# EAGLE schematic aqc-rev2 (EAGLE 8.3.1)

## Sheet 1 of 12
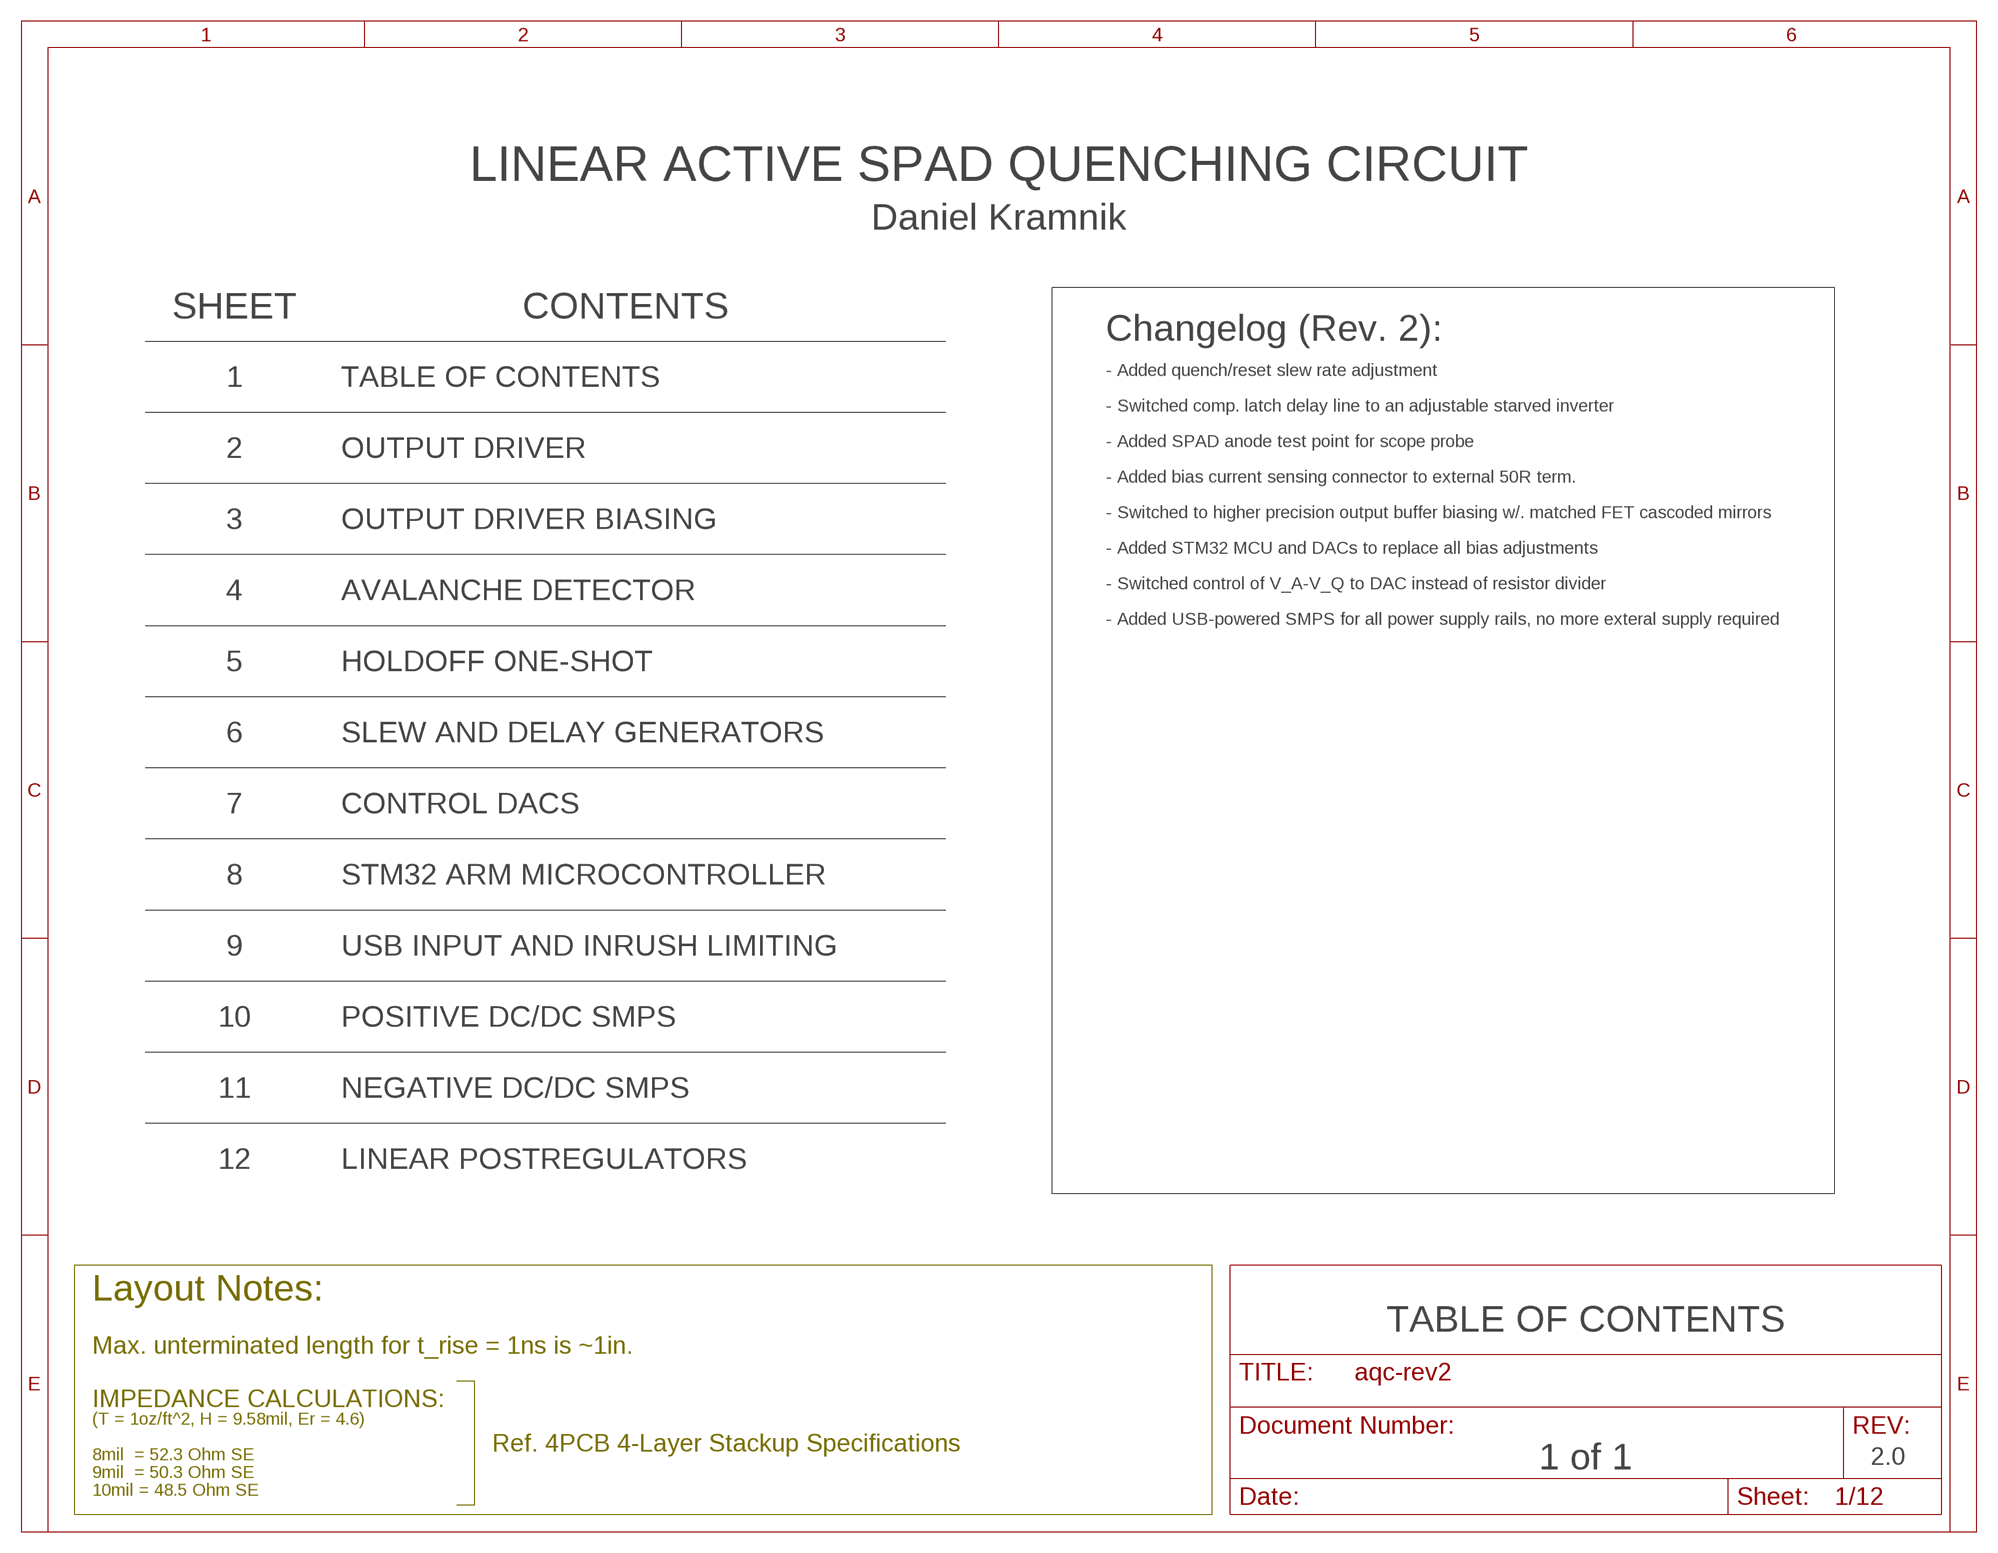
[diagram p0: schematic, sheet 1]

### Notes on the sheet
- LINEAR ACTIVE SPAD QUENCHING CIRCUIT
- Daniel Kramnik
- SHEET | CONTENTS
- Changelog (Rev. 2):
- 1 | TABLE OF CONTENTS | - Added quench/reset slew rate adjustment
- - Switched comp. latch delay line to an adjustable starved inverter
- 2 | OUTPUT DRIVER | - Added SPAD anode test point for scope probe
- - Added bias current sensing connector to external 50R term.
- 3 | OUTPUT DRIVER BIASING | - Switched to higher precision output buffer biasing w/. matched FET cascoded mirrors
- - Added STM32 MCU and DACs to replace all bias adjustments
- 4 | AVALANCHE DETECTOR | - Switched control of V_A-V_Q to DAC instead of resistor divider
- - Added USB-powered SMPS for all power supply rails, no more exteral supply required
- 5 | HOLDOFF ONE-SHOT
- 6 | SLEW AND DELAY GENERATORS
- 7 | CONTROL DACS
- 8 | STM32 ARM MICROCONTROLLER
- 9 | USB INPUT AND INRUSH LIMITING
- 10 | POSITIVE DC/DC SMPS
- 11 | NEGATIVE DC/DC SMPS
- 12 | LINEAR POSTREGULATORS
- Layout Notes:
- TABLE OF CONTENTS
- Max. unterminated length for t_rise = 1ns is ~1in.
- IMPEDANCE CALCULATIONS:
- (T = 1oz/ft^2, H = 9.58mil, Er = 4.6)
- Ref. 4PCB 4-Layer Stackup Specifications | 1 of 1 | 2.0
- 8mil  = 52.3 Ohm SE
- 9mil  = 50.3 Ohm SE
- 10mil = 48.5 Ohm SE

## Sheet 2 of 12
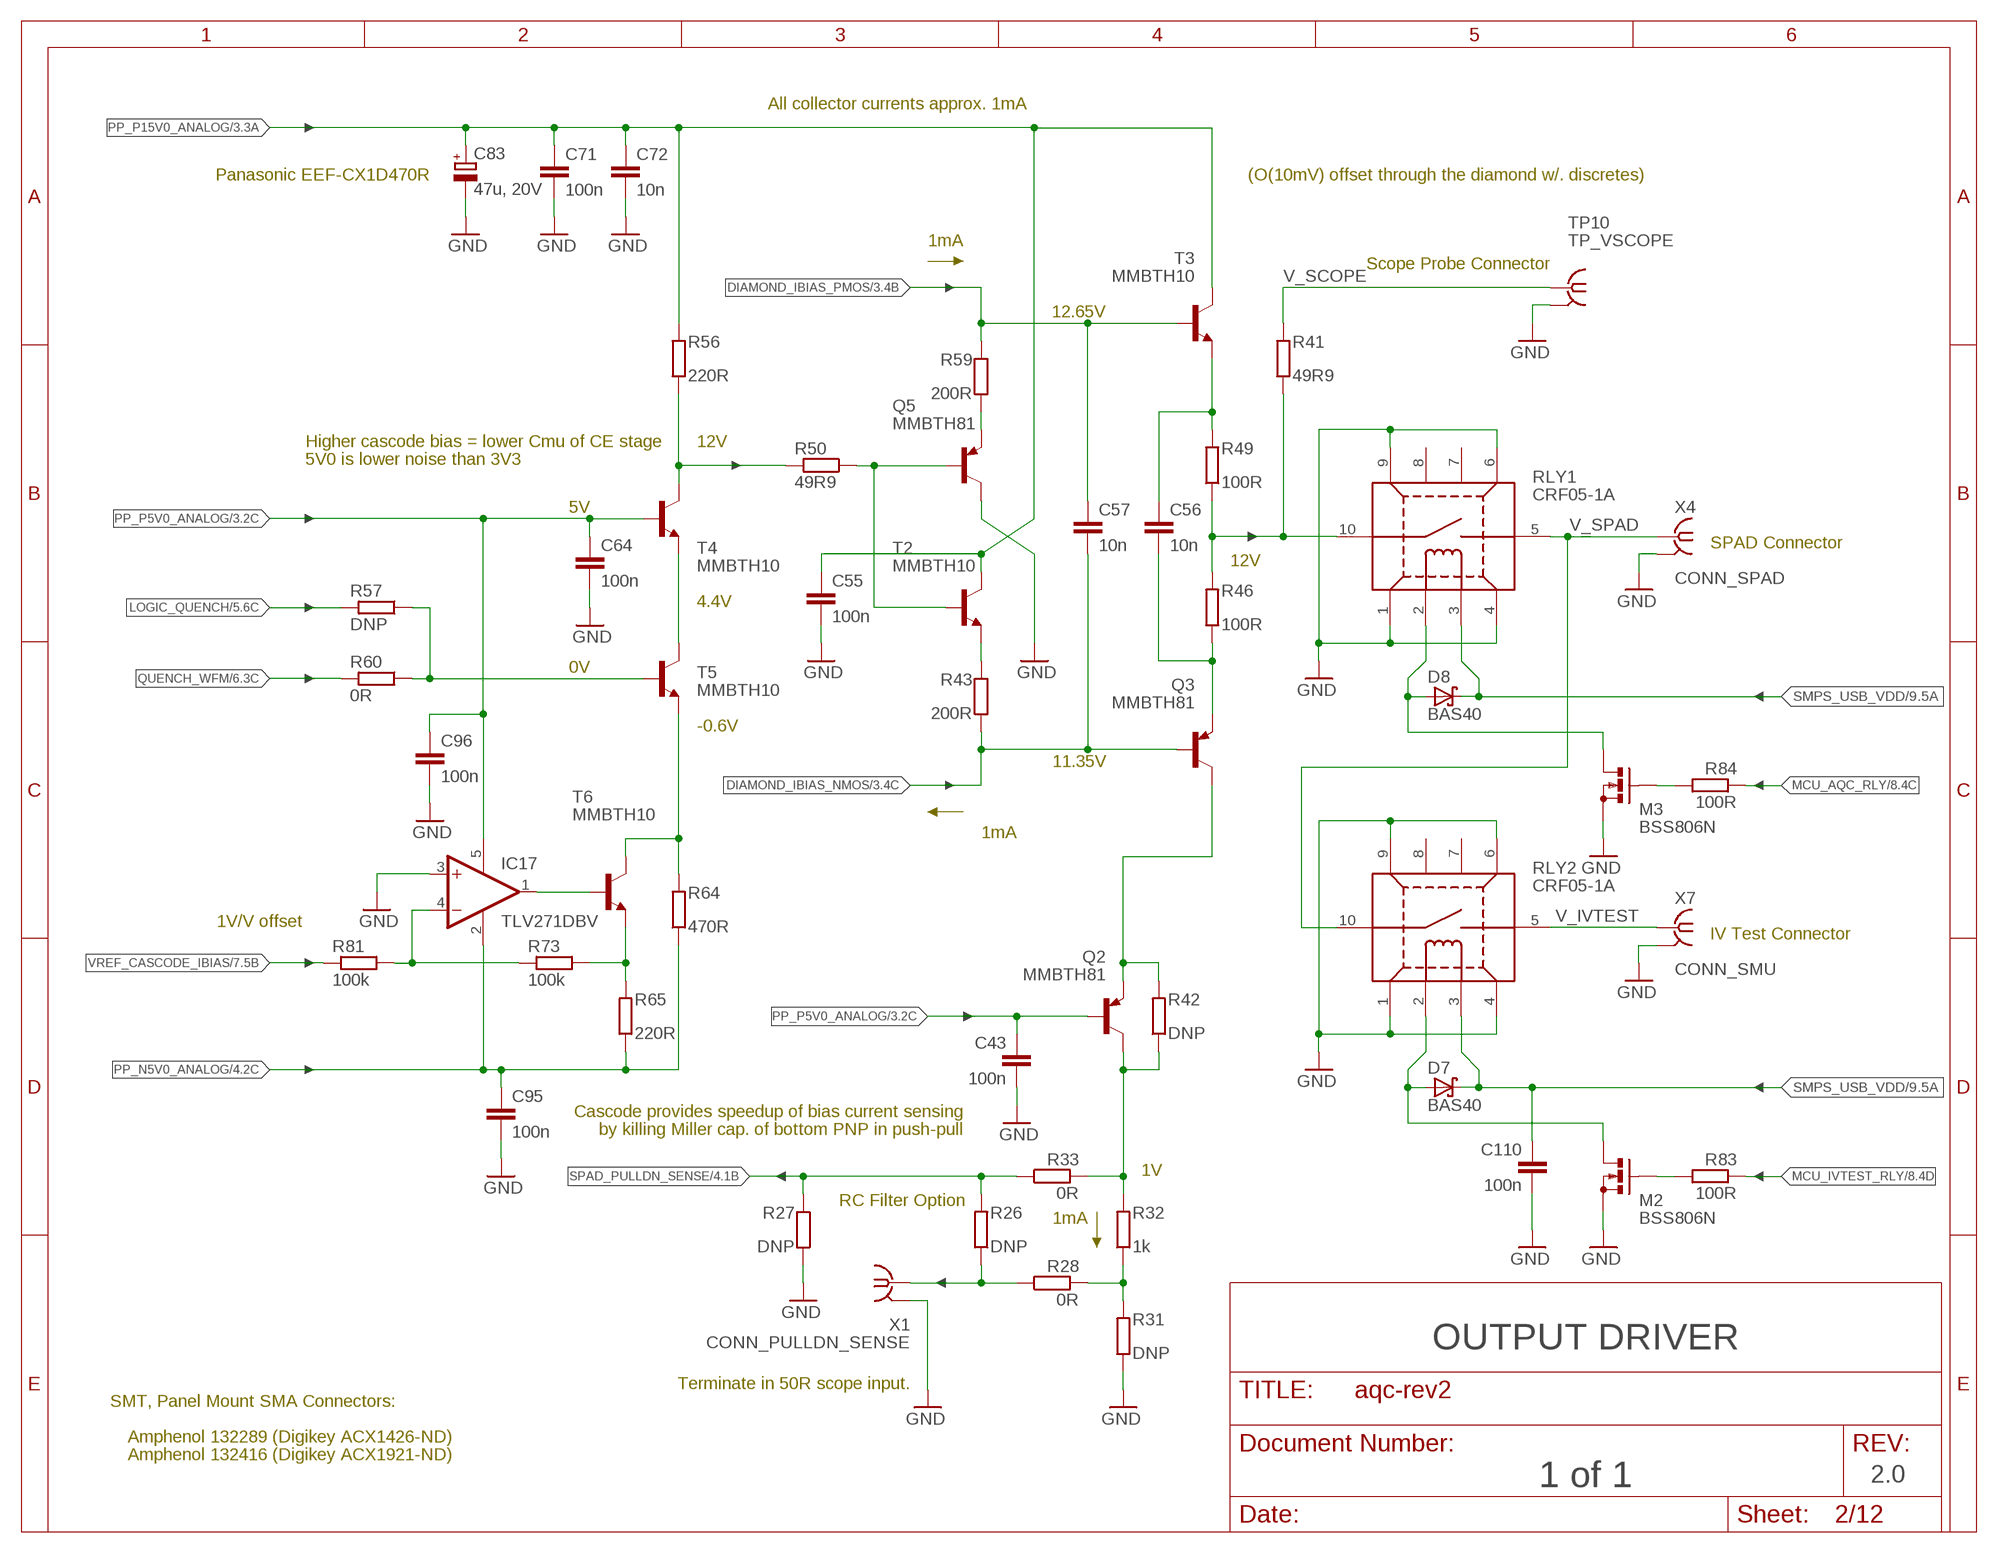
[diagram p1: schematic, sheet 2]

### Parts
C43  100n  C-EUC0603  [C0603]
C55  100n  C-EUC0603  [C0603]
C56  10n  C-EUC0603  [C0603]
C57  10n  C-EUC0603  [C0603]
C64  100n  C-EUC0603  [C0603]
C71  100n  C-EUC0603  [C0603]
C72  10n  C-EUC0603  [C0603]
C83  47u, 20V  CPOL-EUCT7343  [CT7343]
C95  100n  C-EUC0603  [C0603]
C96  100n  C-EUC0603  [C0603]
C110  100n  C-EUC0603  [C0603]
D7  BAS40  [SOT23]
D8  BAS40  [SOT23]
IC17  TLV271DBV  [SOT23-5]
M2  BSS806N  [SOT23R_INFINEON]
M3  BSS806N  [SOT23R_INFINEON]
Q2  MMBTH81  MMBTH81LT1SMD  [SOT23-BEC]
Q3  MMBTH81  MMBTH81LT1SMD  [SOT23-BEC]
Q5  MMBTH81  MMBTH81LT1SMD  [SOT23-BEC]
R26  DNP  R-EU_R0603  [R0603]
R27  DNP  R-EU_R0603  [R0603]
R28  0R  R-EU_R0603  [R0603]
R31  DNP  R-EU_R0603  [R0603]
R32  1k  R-EU_R0603  [R0603]
R33  0R  R-EU_R0603  [R0603]
R41  49R9  R-EU_R0603  [R0603]
R42  DNP  R-EU_R0603  [R0603]
R43  200R  R-EU_R0603  [R0603]
R46  100R  R-EU_R0603  [R0603]
R49  100R  R-EU_R0603  [R0603]
R50  49R9  R-EU_R0603  [R0603]
R56  220R  R-EU_R0603  [R0603]
R57  DNP  R-EU_R0603  [R0603]
R59  200R  R-EU_R0603  [R0603]
R60  0R  R-EU_R0603  [R0603]
R64  470R  R-EU_R0603  [R0603]
R65  220R  R-EU_R0603  [R0603]
R73  100k  R-EU_R0603  [R0603]
R81  100k  R-EU_R0603  [R0603]
R83  100R  R-EU_R0603  [R0603]
R84  100R  R-EU_R0603  [R0603]
RLY1  CRF05-1A  MEDER_CRF05-1A  [MEDER_RELAY_CRF]
RLY2  CRF05-1A  MEDER_CRF05-1A  [MEDER_RELAY_CRF]
T2  MMBTH10  MMBTH10LT1-NPN-SOT23-BEC  [SOT23-BEC]
T3  MMBTH10  MMBTH10LT1-NPN-SOT23-BEC  [SOT23-BEC]
T4  MMBTH10  MMBTH10LT1-NPN-SOT23-BEC  [SOT23-BEC]
T5  MMBTH10  MMBTH10LT1-NPN-SOT23-BEC  [SOT23-BEC]
T6  MMBTH10  MMBTH10LT1-NPN-SOT23-BEC  [SOT23-BEC]
TP10  TP_VSCOPE  TP-SCOPE_H  [JOHNSON-129-0701-30X]
X1  CONN_PULLDN_SENSE  SMA-142-0711-871/876  [J502-ND-142-0711-871/876]
X4  CONN_SPAD  SMA-142-0711-871/876  [J502-ND-142-0711-871/876]
X7  CONN_SMU  SMA-142-0711-871/876  [J502-ND-142-0711-871/876]

### Nets
CASC_BIAS_B: IC17.1(OUT) T6.B
CASC_BIAS_C: R64.2 T5.E T6.C
CASC_BIAS_E: R65.2 R73.1 T6.E
CASC_BIAS_VGND: IC17.4(-IN) R73.2 R81.1
CASC_MIDPT: T4.E T5.C
DIAMOND_IBIAS_NMOS: C57.2 Q3.B R43.1 ; also sheet 3
DIAMOND_IBIAS_PMOS: C57.1 R59.2 T3.B ; also sheet 3
GND: C43.2 C55.2 C64.2 C71.2 C72.2 C83.- C95.2 C96.2 C110.2 IC17.3(+IN) M2.2(S) M3.2(S) Q5.C R27.1 R31.1 RLY1.1(PIN1) RLY1.4(PIN4) RLY1.6(PIN6) RLY1.9(PIN9) RLY2.1(PIN1) RLY2.4(PIN4) RLY2.6(PIN6) RLY2.9(PIN9) TP10.GND1(GND) TP10.GND2(GND) X1.G@1(GND) X4.G@1(GND) X7.G@1(GND) ; also sheet 3,4,5,6,7,8,9,10,11,12
LOGIC_QUENCH: R57.2 ; also sheet 5,6
MCU_AQC_RLY: R84.2 ; also sheet 8
MCU_IVTEST_RLY: R83.2 ; also sheet 8
N$2: R57.1 R60.1 T5.B
N$3: M3.1(G) R84.1
N$4: D8.1(A) M3.3(D) RLY1.2(PIN2)
N$5: C56.1 R49.2 T3.E
N$6: D7.1(A) M2.3(D) RLY2.2(PIN2)
N$10: Q2.E Q3.C R42.2
N$11: Q5.E R59.1
N$13: R43.2 T2.E
N$14: C56.2 Q3.E R46.1
N$15: M2.1(G) R83.1
N$21: Q5.B R50.1 T2.B
N$22: R50.2 R56.1 T4.C
N$23: R41.1 R46.2 R49.1 RLY1.10(PIN10)
N$27: Q2.C R32.2 R33.2 R42.1
N$28: R28.2 R31.2 R32.1
N$32: R26.1 R28.1 X1.1
PP_N5V0_ANALOG: C95.1 IC17.2(V-) R64.1 R65.1 ; also sheet 4,6,12
PP_P5V0_ANALOG: C43.1 C64.1 C96.1 IC17.5(V+) Q2.B T4.B ; also sheet 3,4,6,7,12
PP_P15V0_ANALOG: C55.1 C71.1 C72.1 C83.+ R56.2 T2.C T3.C ; also sheet 3,12
QUENCH_WFM: R60.2 ; also sheet 6
SMPS_USB_VDD: C110.1 D7.3(C) D8.3(C) RLY1.3(PIN3) RLY2.3(PIN3) ; also sheet 9,10,11
SPAD_PULLDN_SENSE: R26.2 R27.2 R33.1 ; also sheet 4
V_IVTEST: RLY2.5(PIN5) X7.1
V_SCOPE: R41.2 TP10.SIG
V_SPAD: RLY1.5(PIN5) RLY2.10(PIN10) X4.1
VREF_CASCODE_IBIAS: R81.2 ; also sheet 7
Unconnected: RLY1.7(PIN7) RLY1.8(PIN8) RLY2.7(PIN7) RLY2.8(PIN8)

### Notes on the sheet
- All collector currents approx. 1mA
- Panasonic EEF-CX1D470R | (O(10mV) offset through the diamond w/. discretes)
- 1mA
- Scope Probe Connector
- 12.65V
- Higher cascode bias = lower Cmu of CE stage | 12V
- 5V0 is lower noise than 3V3
- 5V
- SPAD Connector
- 12V
- 4.4V
- 0V
- -0.6V
- 11.35V
- 1mA
- 1V/V offset | IV Test Connector
- Cascode provides speedup of bias current sensing
- by killing Miller cap. of bottom PNP in push-pull
- 1V
- RC Filter Option
- 1mA
- OUTPUT DRIVER
- Terminate in 50R scope input.
- SMT, Panel Mount SMA Connectors:
- Amphenol 132289 (Digikey ACX1426-ND)
- Amphenol 132416 (Digikey ACX1921-ND)
- 1 of 1 | 2.0

## Sheet 3 of 12
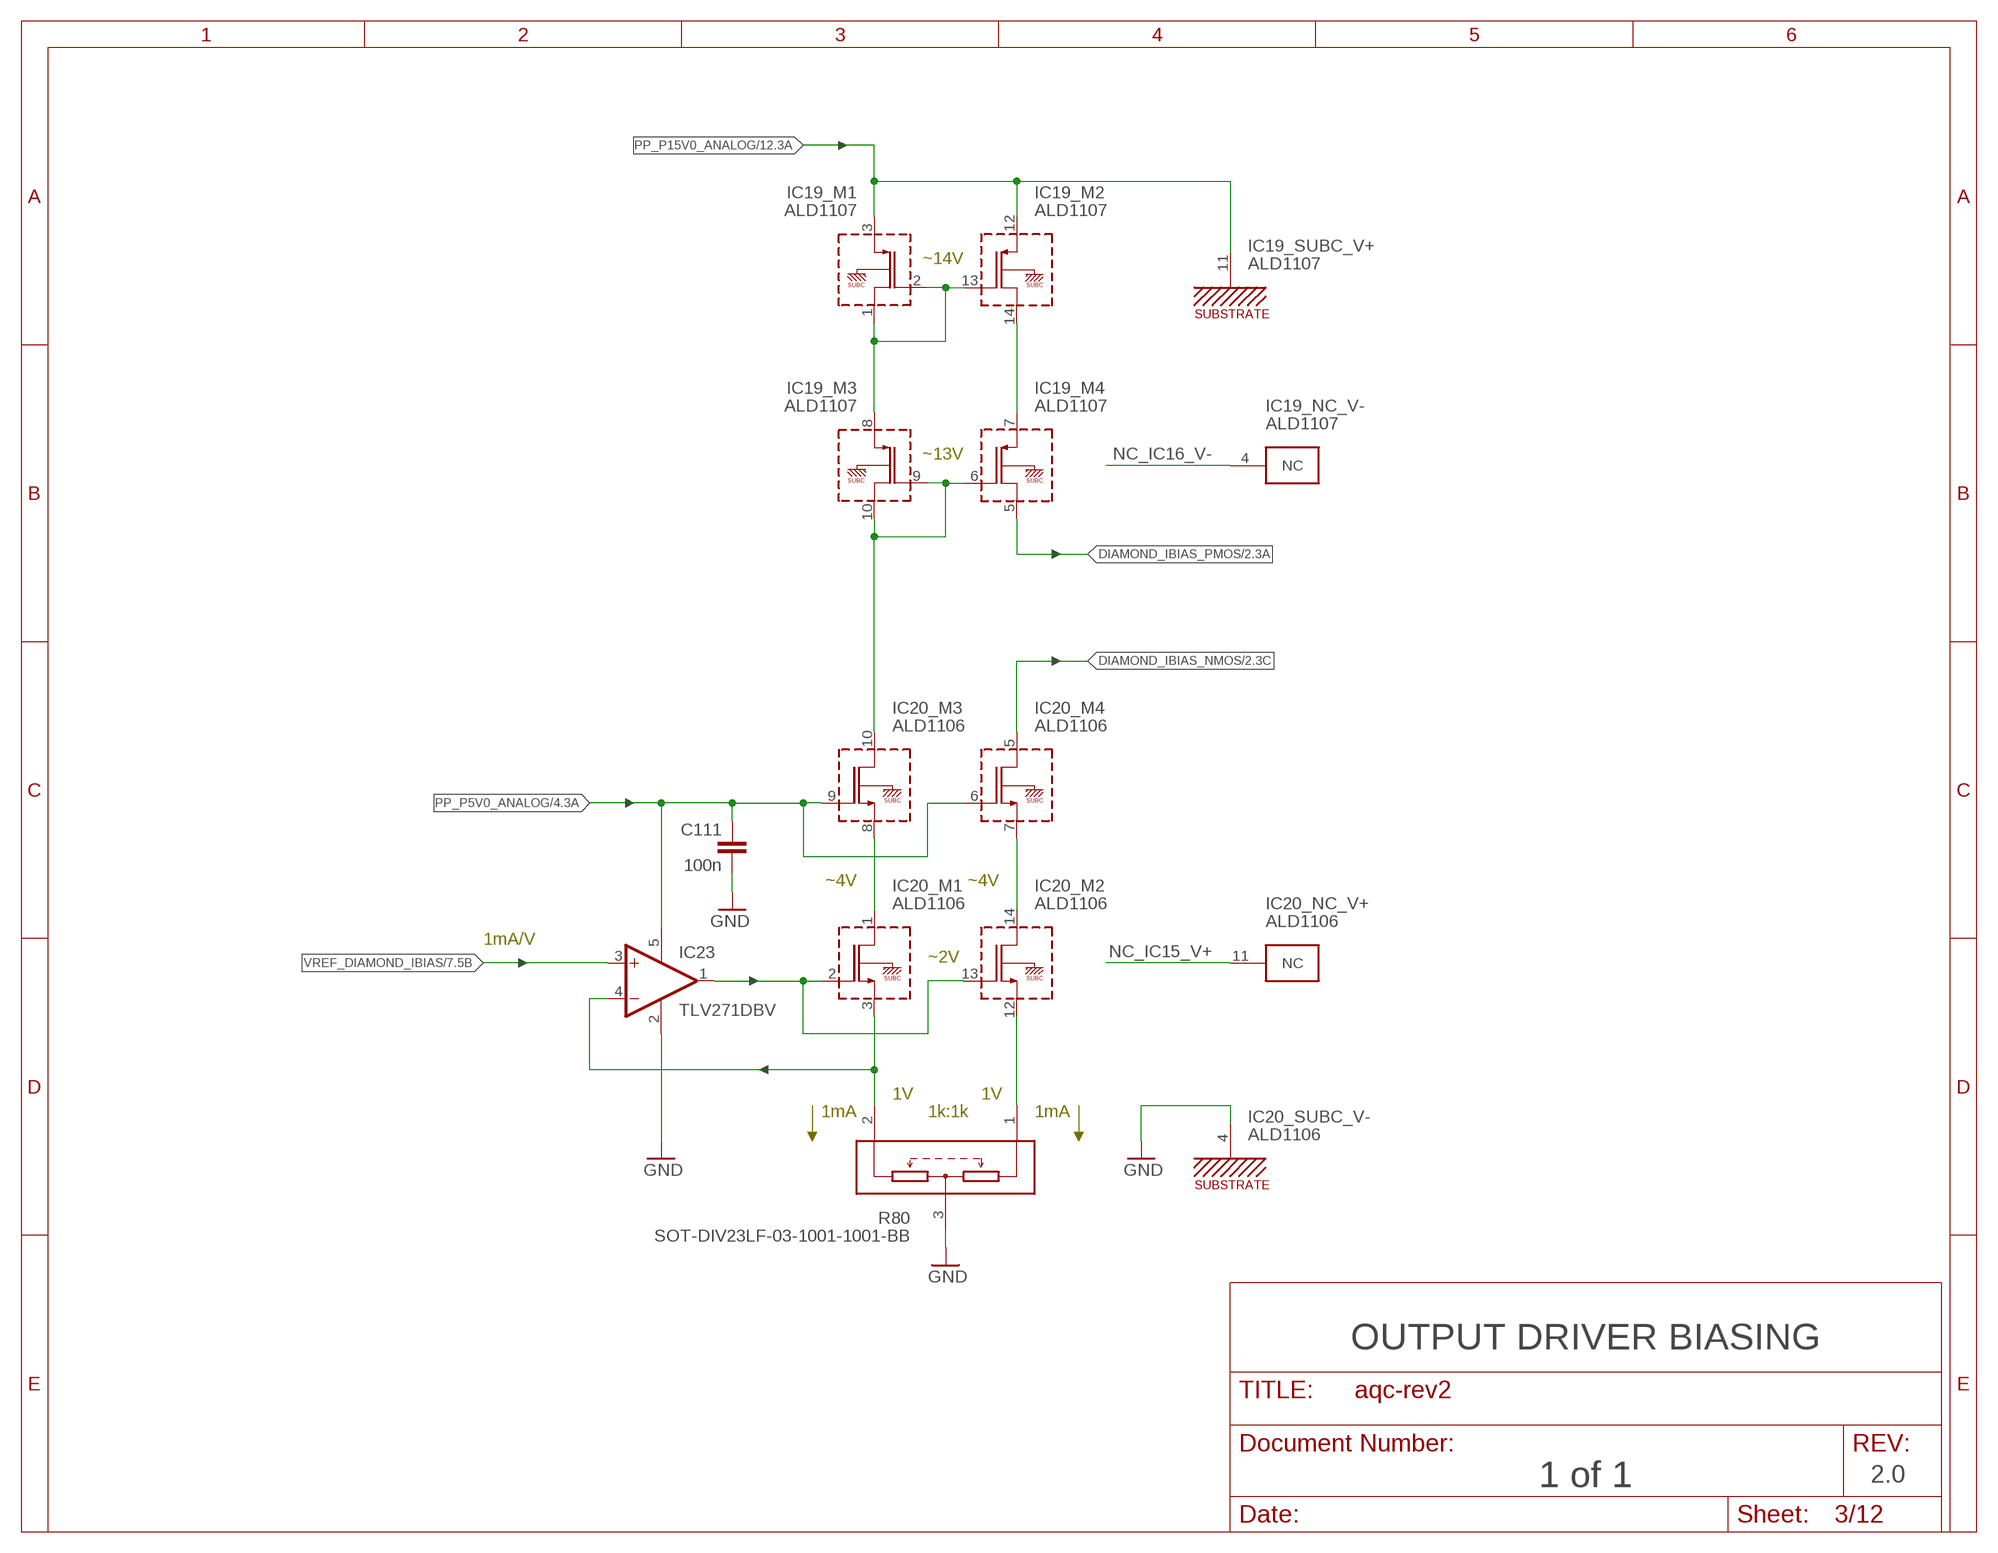
[diagram p2: schematic, sheet 3]

### Parts
C111  100n  C-EUC0603  [C0603]
IC19  ALD1107  [SO14]
IC20  ALD1106  [SO14]
IC23  TLV271DBV  [SOT23-5]
R80  SOT-DIV23LF-03-1001-1001-BB  DIVIDER_SOT23-5  [SOT23C]

### Nets
DIAMOND_IBIAS_NMOS: IC20.5(_M4:D) ; also sheet 2
DIAMOND_IBIAS_PMOS: IC19.5(_M4:D) ; also sheet 2
GND: C111.2 IC20.4(_SUBC_V-:SUBC) IC23.2(V-) R80.3(MIDDLE) ; also sheet 2,4,5,6,7,8,9,10,11,12
N$16: IC20.1(_M1:D) IC20.8(_M3:S)
N$26: IC20.7(_M4:S) IC20.14(_M2:D)
N$50: IC20.3(_M1:S) IC23.4(-IN) R80.2(TOP)
N$78: IC20.2(_M1:G) IC20.13(_M2:G) IC23.1(OUT)
N$81: IC20.12(_M2:S) R80.1(BOTTOM)
N$88: IC19.1(_M1:D) IC19.2(_M1:G) IC19.8(_M3:S) IC19.13(_M2:G)
N$89: IC19.7(_M4:S) IC19.14(_M2:D)
N$90: IC19.6(_M4:G) IC19.9(_M3:G) IC19.10(_M3:D) IC20.10(_M3:D)
NC_IC15_V+: IC20.11(_NC_V+:NC)
NC_IC16_V-: IC19.4(_NC_V-:NC)
PP_P5V0_ANALOG: C111.1 IC20.6(_M4:G) IC20.9(_M3:G) IC23.5(V+) ; also sheet 2,4,6,7,12
PP_P15V0_ANALOG: IC19.3(_M1:S) IC19.11(_SUBC_V+:SUBC) IC19.12(_M2:S) ; also sheet 2,12
VREF_DIAMOND_IBIAS: IC23.3(+IN) ; also sheet 7

### Notes on the sheet
- ~14V
- ~13V
- ~4V | ~4V
- 1mA/V
- ~2V
- 1V | 1V
- 1mA | 1k:1k | 1mA
- OUTPUT DRIVER BIASING
- 1 of 1 | 2.0

## Sheet 4 of 12
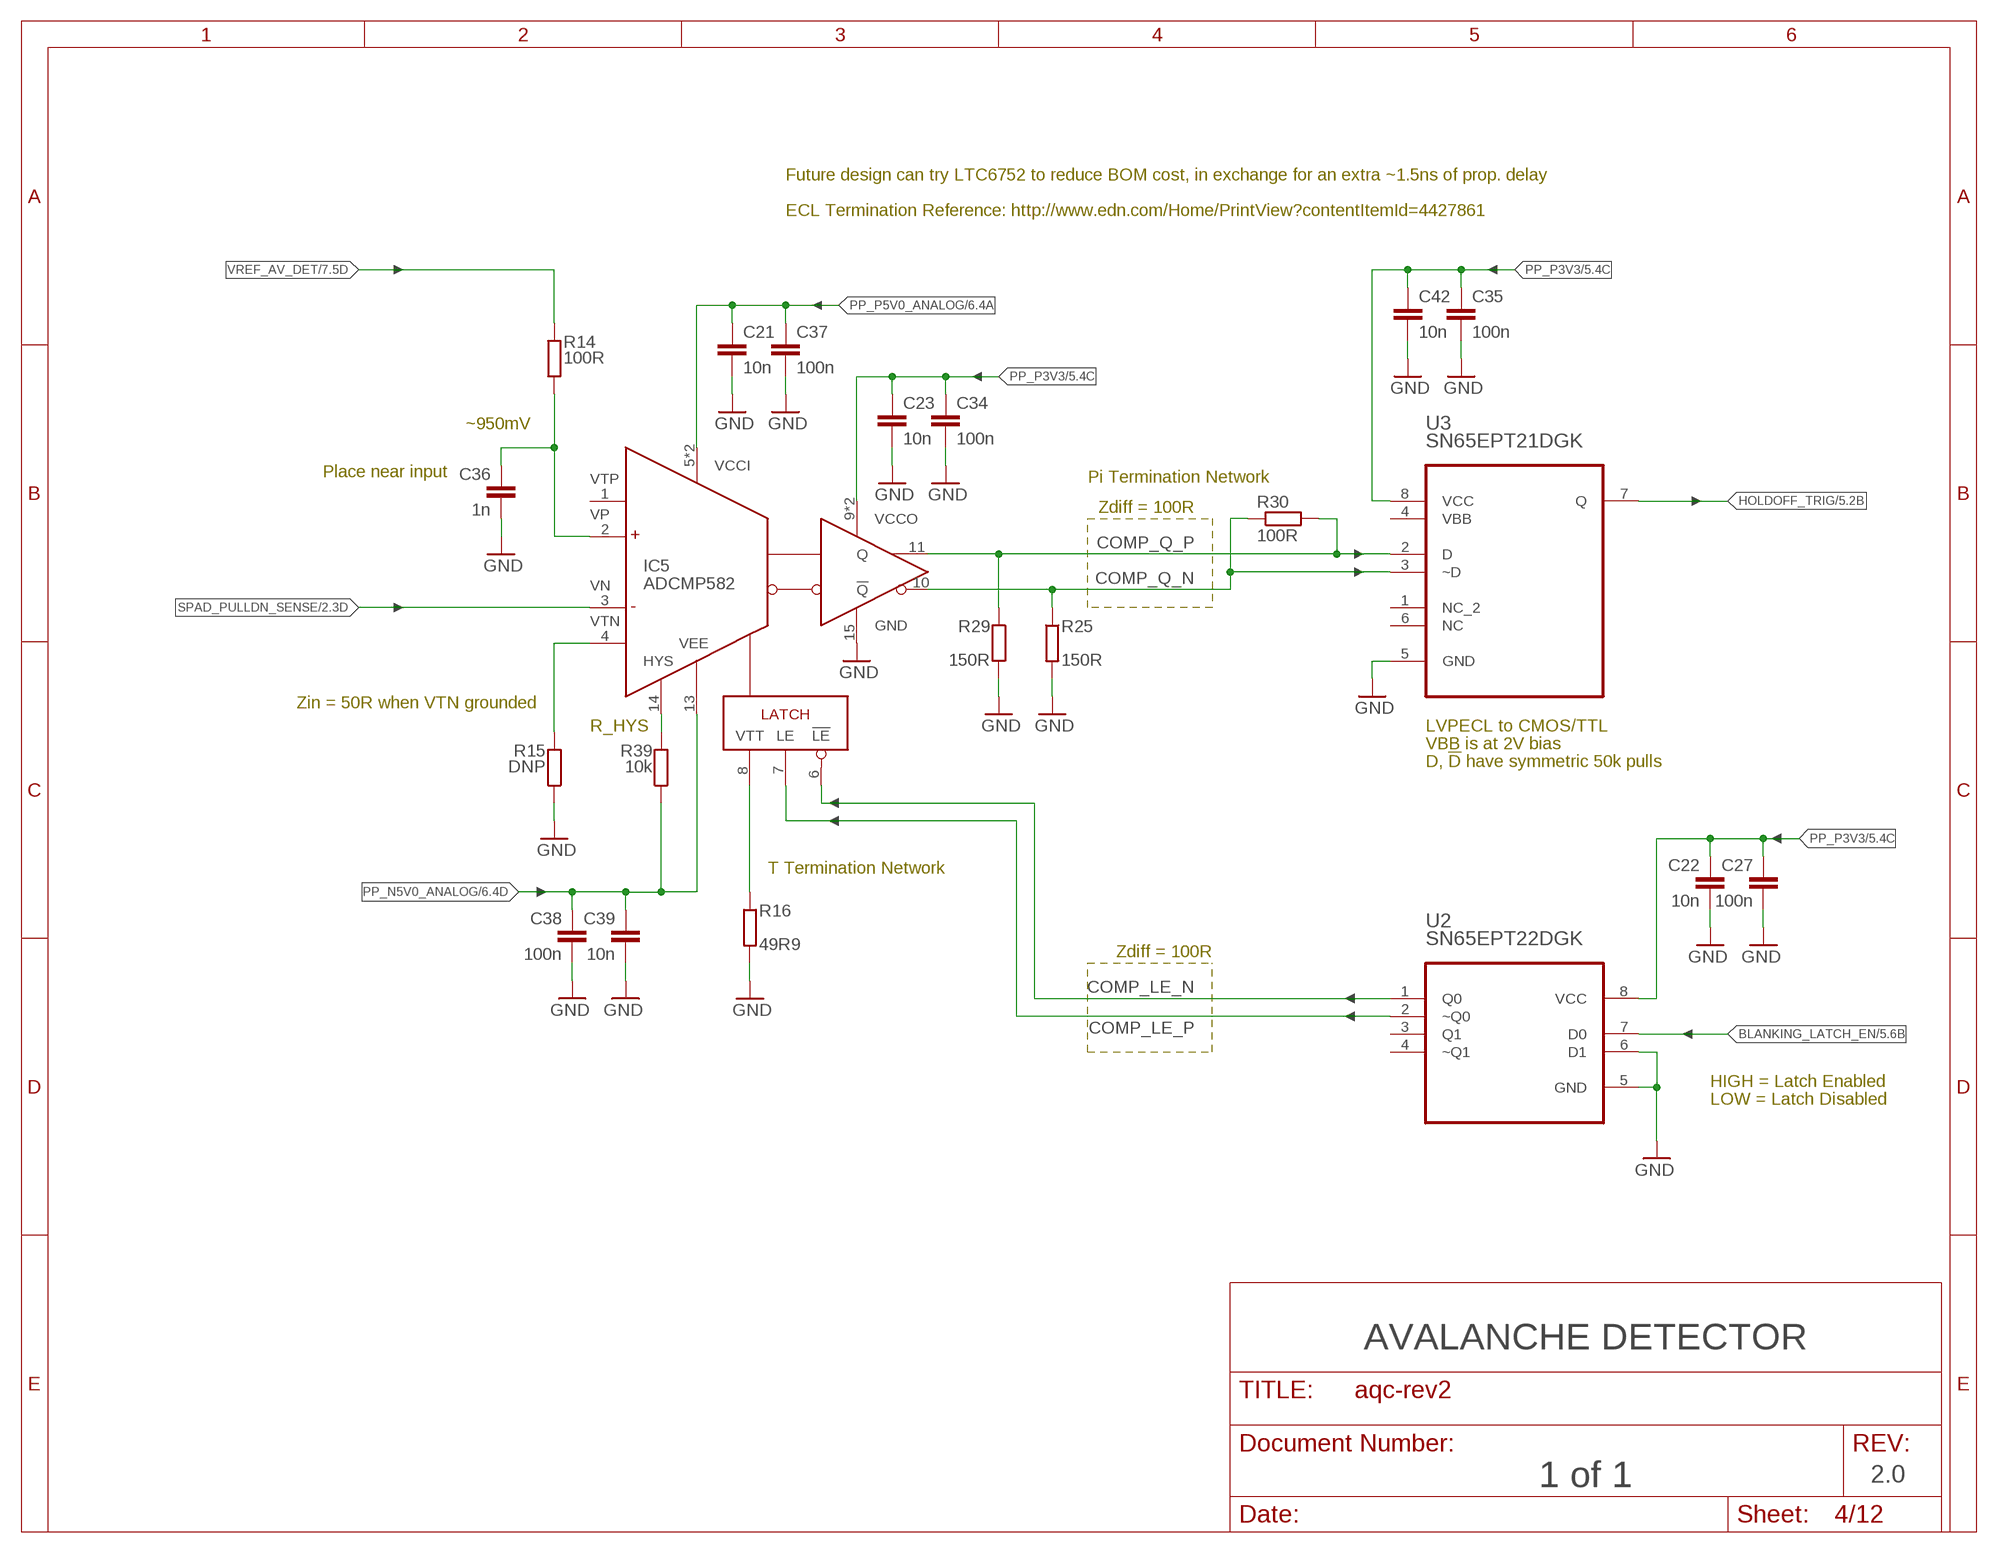
[diagram p3: schematic, sheet 4]

### Parts
C21  10n  C-EUC0402  [C0402]
C22  10n  C-EUC0402  [C0402]
C23  10n  C-EUC0402  [C0402]
C27  100n  C-EUC0402  [C0402]
C34  100n  C-EUC0402  [C0402]
C35  100n  C-EUC0402  [C0402]
C36  1n  C-EUC0603  [C0603]
C37  100n  C-EUC0402  [C0402]
C38  100n  C-EUC0402  [C0402]
C39  10n  C-EUC0402  [C0402]
C42  10n  C-EUC0402  [C0402]
IC5  ADCMP582  [QFN50P300X300X80-16N]
R14  100R  R-EU_R0603  [R0603]
R15  DNP  R-EU_R0603  [R0603]
R16  49R9  R-EU_R0603  [R0603]
R25  150R  R-EU_R0402  [R0402]
R29  150R  R-EU_R0402  [R0402]
R30  100R  R-EU_R0402  [R0402]
R39  10k  R-EU_R0603  [R0603]
U2  SN65EPT22DGK  [SOP65P490X110-8N]
U3  SN65EPT21DGK  [SOP65P490X110-8N]

### Nets
BLANKING_LATCH_EN: U2.7(D0) ; also sheet 5,6
COMP_HYS: IC5.14(HYS) R39.2
COMP_LE_N [100OHM_DIFF]: IC5.6(!LE) U2.1(Q0)
COMP_LE_P [100OHM_DIFF]: IC5.7(LE) U2.2(~Q0)
COMP_Q_N [100OHM_DIFF]: IC5.10(!Q) R25.1 R30.1 U3.3(~D)
COMP_Q_P [100OHM_DIFF]: IC5.11(Q) R29.1 R30.2 U3.2(D)
COMP_VP: C36.1 IC5.2(VP) R14.1
COMP_VTN: IC5.4(VTN) R15.2
COMP_VTT: IC5.8(VTT) R16.1
GND: C21.2 C22.2 C23.2 C27.2 C34.2 C35.2 C36.2 C37.2 C38.2 C39.2 C42.2 IC5.15(GND) R15.1 R16.2 R25.2 R29.2 U2.5(GND) U2.6(D1) U3.5(GND) ; also sheet 2,3,5,6,7,8,9,10,11,12
HOLDOFF_TRIG: U3.7(Q) ; also sheet 5
PP_N5V0_ANALOG: C38.1 C39.1 IC5.13(VEE) R39.1 ; also sheet 2,6,12
PP_P3V3: C22.1 C23.1 C27.1 C34.1 C35.1 C42.1 IC5.9(VCCO) IC5.12(VCCO) U2.8(VCC) U3.8(VCC) ; also sheet 5,6,7,8,9
PP_P5V0_ANALOG: C21.1 C37.1 IC5.5(VCCI) IC5.16(VCCI) ; also sheet 2,3,6,7,12
SPAD_PULLDN_SENSE: IC5.3(VN) ; also sheet 2
VREF_AV_DET: R14.2 ; also sheet 7
Unconnected: IC5.1(VTP) U2.3(Q1) U2.4(~Q1) U3.1(NC_2) U3.6(NC)

### Notes on the sheet
- Future design can try LTC6752 to reduce BOM cost, in exchange for an extra ~1.5ns of prop. delay
- ECL Termination Reference: http://www.edn.com/Home/PrintView?contentItemId=4427861
- ~950mV
- Place near input
- Pi Termination Network
- Zdiff = 100R
- Zin = 50R when VTN grounded
- R_HYS | LVPECL to CMOS/TTL
- VBB is at 2V bias
- D, !D! have symmetric 50k pulls
- T Termination Network
- Zdiff = 100R
- HIGH = Latch Enabled
- LOW = Latch Disabled
- AVALANCHE DETECTOR
- 1 of 1 | 2.0

## Sheet 5 of 12
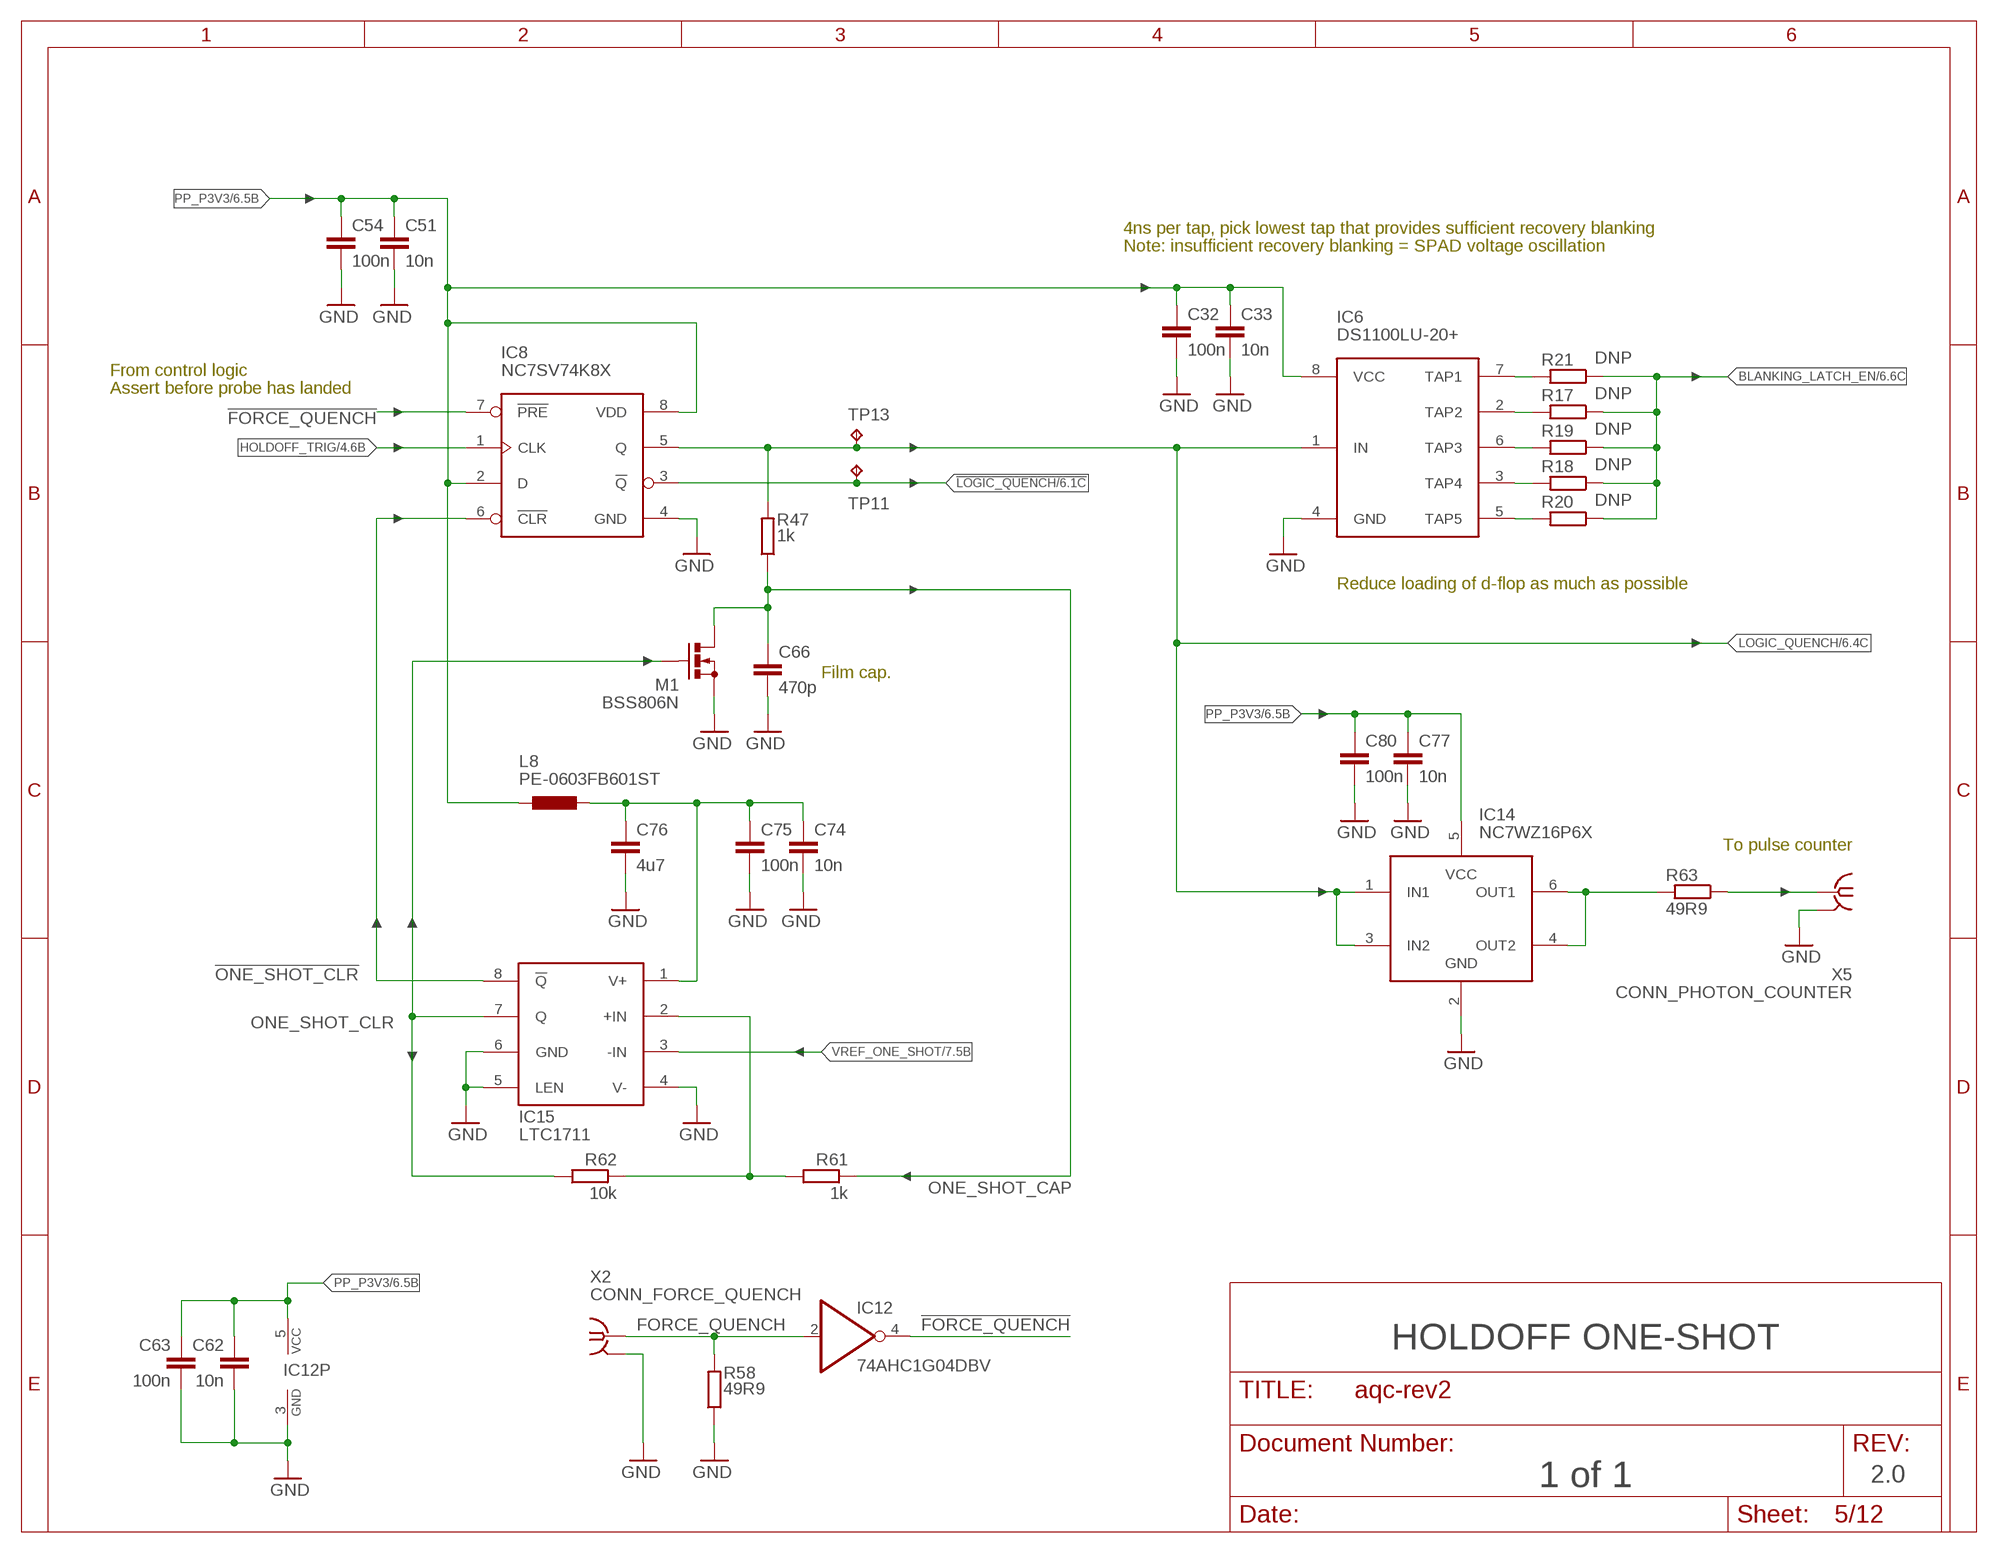
[diagram p4: schematic, sheet 5]

### Parts
C32  100n  C-EUC0402  [C0402]
C33  10n  C-EUC0402  [C0402]
C51  10n  C-EUC0402  [C0402]
C54  100n  C-EUC0402  [C0402]
C62  10n  C-EUC0402  [C0402]
C63  100n  C-EUC0402  [C0402]
C66  470p  C-EUC0603  [C0603]
C74  10n  C-EUC0402  [C0402]
C75  100n  C-EUC0402  [C0402]
C76  4u7  C-EUC0603  [C0603]
C77  10n  C-EUC0402  [C0402]
C80  100n  C-EUC0402  [C0402]
IC6  DS1100LU-20+  DS1100L  [MSOP8]
IC8  NC7SV74K8X  [US8_3.1MM_JDEC_MO-187]
IC12  74AHC1G04DBV  [SOT23-5]
IC14  NC7WZ16P6X  [SC70-6L]
IC15  LTC1711  [MSOP8]
L8  PE-0603FB601ST  INDUCTOR0603  [R0603]
M1  BSS806N  [SOT23R_INFINEON]
R17  DNP  R-EU_R0603  [R0603]
R18  DNP  R-EU_R0603  [R0603]
R19  DNP  R-EU_R0603  [R0603]
R20  DNP  R-EU_R0603  [R0603]
R21  DNP  R-EU_R0603  [R0603]
R47  1k  R-EU_R0603  [R0603]
R58  49R9  R-EU_R0603  [R0603]
R61  1k  R-EU_R0603  [R0603]
R62  10k  R-EU_R0603  [R0603]
R63  49R9  R-EU_R0603  [R0603]
TP11  TPTP06R  [TP06R]
TP13  TPTP06R  [TP06R]
X2  CONN_FORCE_QUENCH  SMA-142-0711-871/876  [J502-ND-142-0711-871/876]
X5  CONN_PHOTON_COUNTER  SMA-142-0711-871/876  [J502-ND-142-0711-871/876]

### Nets
!FORCE_QUENCH: IC8.7(!PRE) IC12.4(O)
!LOGIC_QUENCH: IC8.3(!Q) TP11.TP ; also sheet 6
!ONE_SHOT_CLR: IC8.6(!CLR) IC15.8(!Q)
BLANKING_LATCH_EN: R17.1 R18.1 R19.1 R20.1 R21.1 ; also sheet 4,6
FORCE_QUENCH: IC12.2(I) R58.2 X2.1
GND: C32.2 C33.2 C51.2 C54.2 C62.2 C63.2 C66.2 C74.2 C75.2 C76.2 C77.2 C80.2 IC6.4(GND) IC8.4(GND) IC12.3(GND) IC14.2(GND) IC15.4(V-) IC15.5(LEN) IC15.6(GND) M1.2(S) R58.1 X2.G@1(GND) X5.G@1(GND) ; also sheet 2,3,4,6,7,8,9,10,11,12
HOLDOFF_TRIG: IC8.1(CLK) ; also sheet 4
LOGIC_QUENCH: IC6.1(IN) IC8.5(Q) IC14.1(IN1) IC14.3(IN2) R47.2 TP13.TP ; also sheet 2,6
N$25: IC15.2(+IN) R61.1 R62.2
N$29: IC14.4(OUT2) IC14.6(OUT1) R63.2
ONE_SHOT_CAP: C66.1 M1.3(D) R47.1 R61.2
ONE_SHOT_CLR: IC15.7(Q) M1.1(G) R62.1
PHOTON_COUNT_OUT: R63.1 X5.1
PP_P3V3: C32.1 C33.1 C51.1 C54.1 C62.1 C63.1 C77.1 C80.1 IC6.8(VCC) IC8.2(D) IC8.8(VDD) IC12.5(VCC) IC14.5(VCC) L8.1 ; also sheet 4,6,7,8,9
PP_P3V3_COMP: C74.1 C75.1 C76.1 IC15.1(V+) L8.2
TAP1: IC6.7(TAP1) R21.2
TAP2: IC6.2(TAP2) R17.2
TAP3: IC6.6(TAP3) R19.2
TAP4: IC6.3(TAP4) R18.2
TAP5: IC6.5(TAP5) R20.2
VREF_ONE_SHOT: IC15.3(-IN) ; also sheet 7

### Notes on the sheet
- 4ns per tap, pick lowest tap that provides sufficient recovery blanking
- Note: insufficient recovery blanking = SPAD voltage oscillation
- From control logic
- Assert before probe has landed
- Reduce loading of d-flop as much as possible
- Film cap.
- To pulse counter
- HOLDOFF ONE-SHOT
- 1 of 1 | 2.0

## Sheet 6 of 12
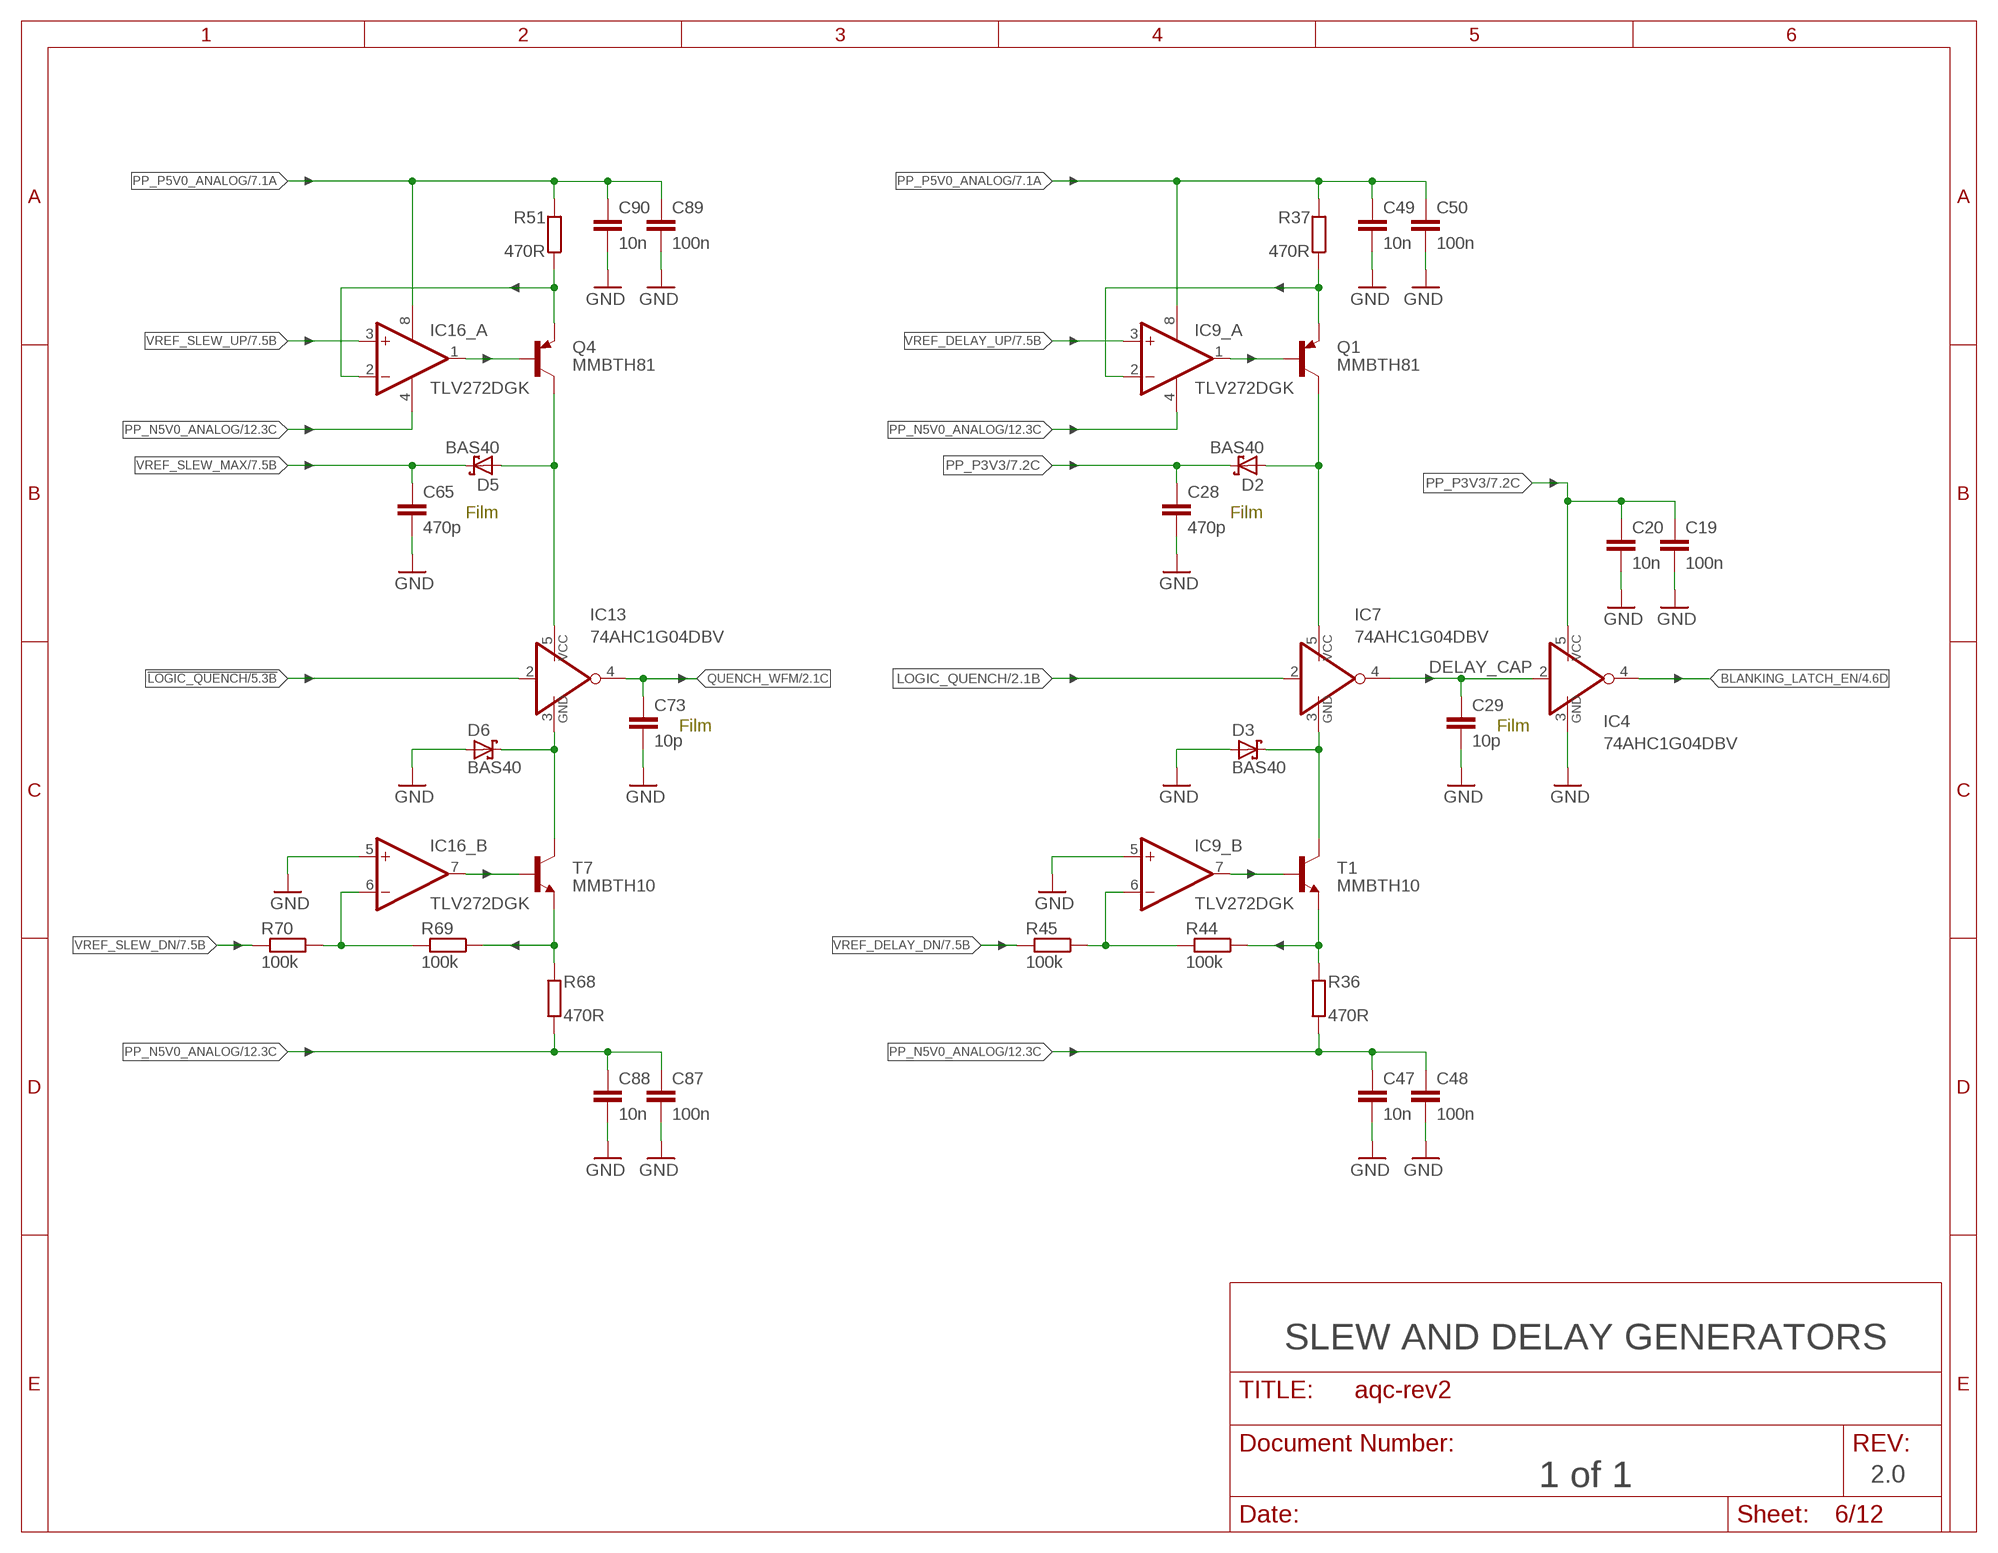
[diagram p5: schematic, sheet 6]

### Parts
C19  100n  C-EUC0402  [C0402]
C20  10n  C-EUC0402  [C0402]
C28  470p  C-EUC0603  [C0603]
C29  10p  C-EUC0603  [C0603]
C47  10n  C-EUC0402  [C0402]
C48  100n  C-EUC0402  [C0402]
C49  10n  C-EUC0402  [C0402]
C50  100n  C-EUC0402  [C0402]
C65  470p  C-EUC0603  [C0603]
C73  10p  C-EUC0603  [C0603]
C87  100n  C-EUC0402  [C0402]
C88  10n  C-EUC0402  [C0402]
C89  100n  C-EUC0402  [C0402]
C90  10n  C-EUC0402  [C0402]
D2  BAS40  [SOT23]
D3  BAS40  [SOT23]
D5  BAS40  [SOT23]
D6  BAS40  [SOT23]
IC4  74AHC1G04DBV  [SOT23-5]
IC7  74AHC1G04DBV  [SOT23-5]
IC9  TLV272DGK  [MSOP8]
IC13  74AHC1G04DBV  [SOT23-5]
IC16  TLV272DGK  [MSOP8]
Q1  MMBTH81  MMBTH81LT1SMD  [SOT23-BEC]
Q4  MMBTH81  MMBTH81LT1SMD  [SOT23-BEC]
R36  470R  R-EU_R0603  [R0603]
R37  470R  R-EU_R0603  [R0603]
R44  100k  R-EU_R0603  [R0603]
R45  100k  R-EU_R0603  [R0603]
R51  470R  R-EU_R0603  [R0603]
R68  470R  R-EU_R0603  [R0603]
R69  100k  R-EU_R0603  [R0603]
R70  100k  R-EU_R0603  [R0603]
T1  MMBTH10  MMBTH10LT1-NPN-SOT23-BEC  [SOT23-BEC]
T7  MMBTH10  MMBTH10LT1-NPN-SOT23-BEC  [SOT23-BEC]

### Nets
!LOGIC_QUENCH: IC13.2(I) ; also sheet 5
BLANKING_LATCH_EN: IC4.4(O) ; also sheet 4,5
DELAY_CAP: C29.1 IC4.2(I) IC7.4(O)
GND: C19.2 C20.2 C28.2 C29.2 C47.2 C48.2 C49.2 C50.2 C65.2 C73.2 C87.2 C88.2 C89.2 C90.2 D3.1(A) D6.1(A) IC4.3(GND) IC9.5(_B:+IN) IC16.5(_B:+IN) ; also sheet 2,3,4,5,7,8,9,10,11,12
LOGIC_QUENCH: IC7.2(I) ; also sheet 2,5
N$1: IC16.2(_A:-IN) Q4.E R51.1
N$7: D5.1(A) IC13.5(VCC) Q4.C
N$17: D6.3(C) IC13.3(GND) T7.C
N$38: IC16.1(_A:OUT) Q4.B
N$42: IC16.7(_B:OUT) T7.B
N$43: IC16.6(_B:-IN) R69.2 R70.1
N$44: D2.1(A) IC7.5(VCC) Q1.C
N$45: D3.3(C) IC7.3(GND) T1.C
N$46: IC9.7(_B:OUT) T1.B
N$47: IC9.6(_B:-IN) R44.2 R45.1
N$48: IC9.2(_A:-IN) Q1.E R37.1
N$49: IC9.1(_A:OUT) Q1.B
N$82: R68.2 R69.1 T7.E
N$86: R36.2 R44.1 T1.E
PP_N5V0_ANALOG: C47.1 C48.1 C87.1 C88.1 IC9.4(_A:V-) IC16.4(_A:V-) R36.1 R68.1 ; also sheet 2,4,12
PP_P3V3: C19.1 C20.1 C28.1 D2.3(C) IC4.5(VCC) ; also sheet 4,5,7,8,9
PP_P5V0_ANALOG: C49.1 C50.1 C89.1 C90.1 IC9.8(_A:V+) IC16.8(_A:V+) R37.2 R51.2 ; also sheet 2,3,4,7,12
QUENCH_WFM: C73.1 IC13.4(O) ; also sheet 2
VREF_DELAY_DN: R45.2 ; also sheet 7
VREF_DELAY_UP: IC9.3(_A:+IN) ; also sheet 7
VREF_SLEW_DN: R70.2 ; also sheet 7
VREF_SLEW_MAX: C65.1 D5.3(C) ; also sheet 7
VREF_SLEW_UP: IC16.3(_A:+IN) ; also sheet 7

### Notes on the sheet
- Film | Film
- Film | Film
- SLEW AND DELAY GENERATORS
- 1 of 1 | 2.0

## Sheet 7 of 12
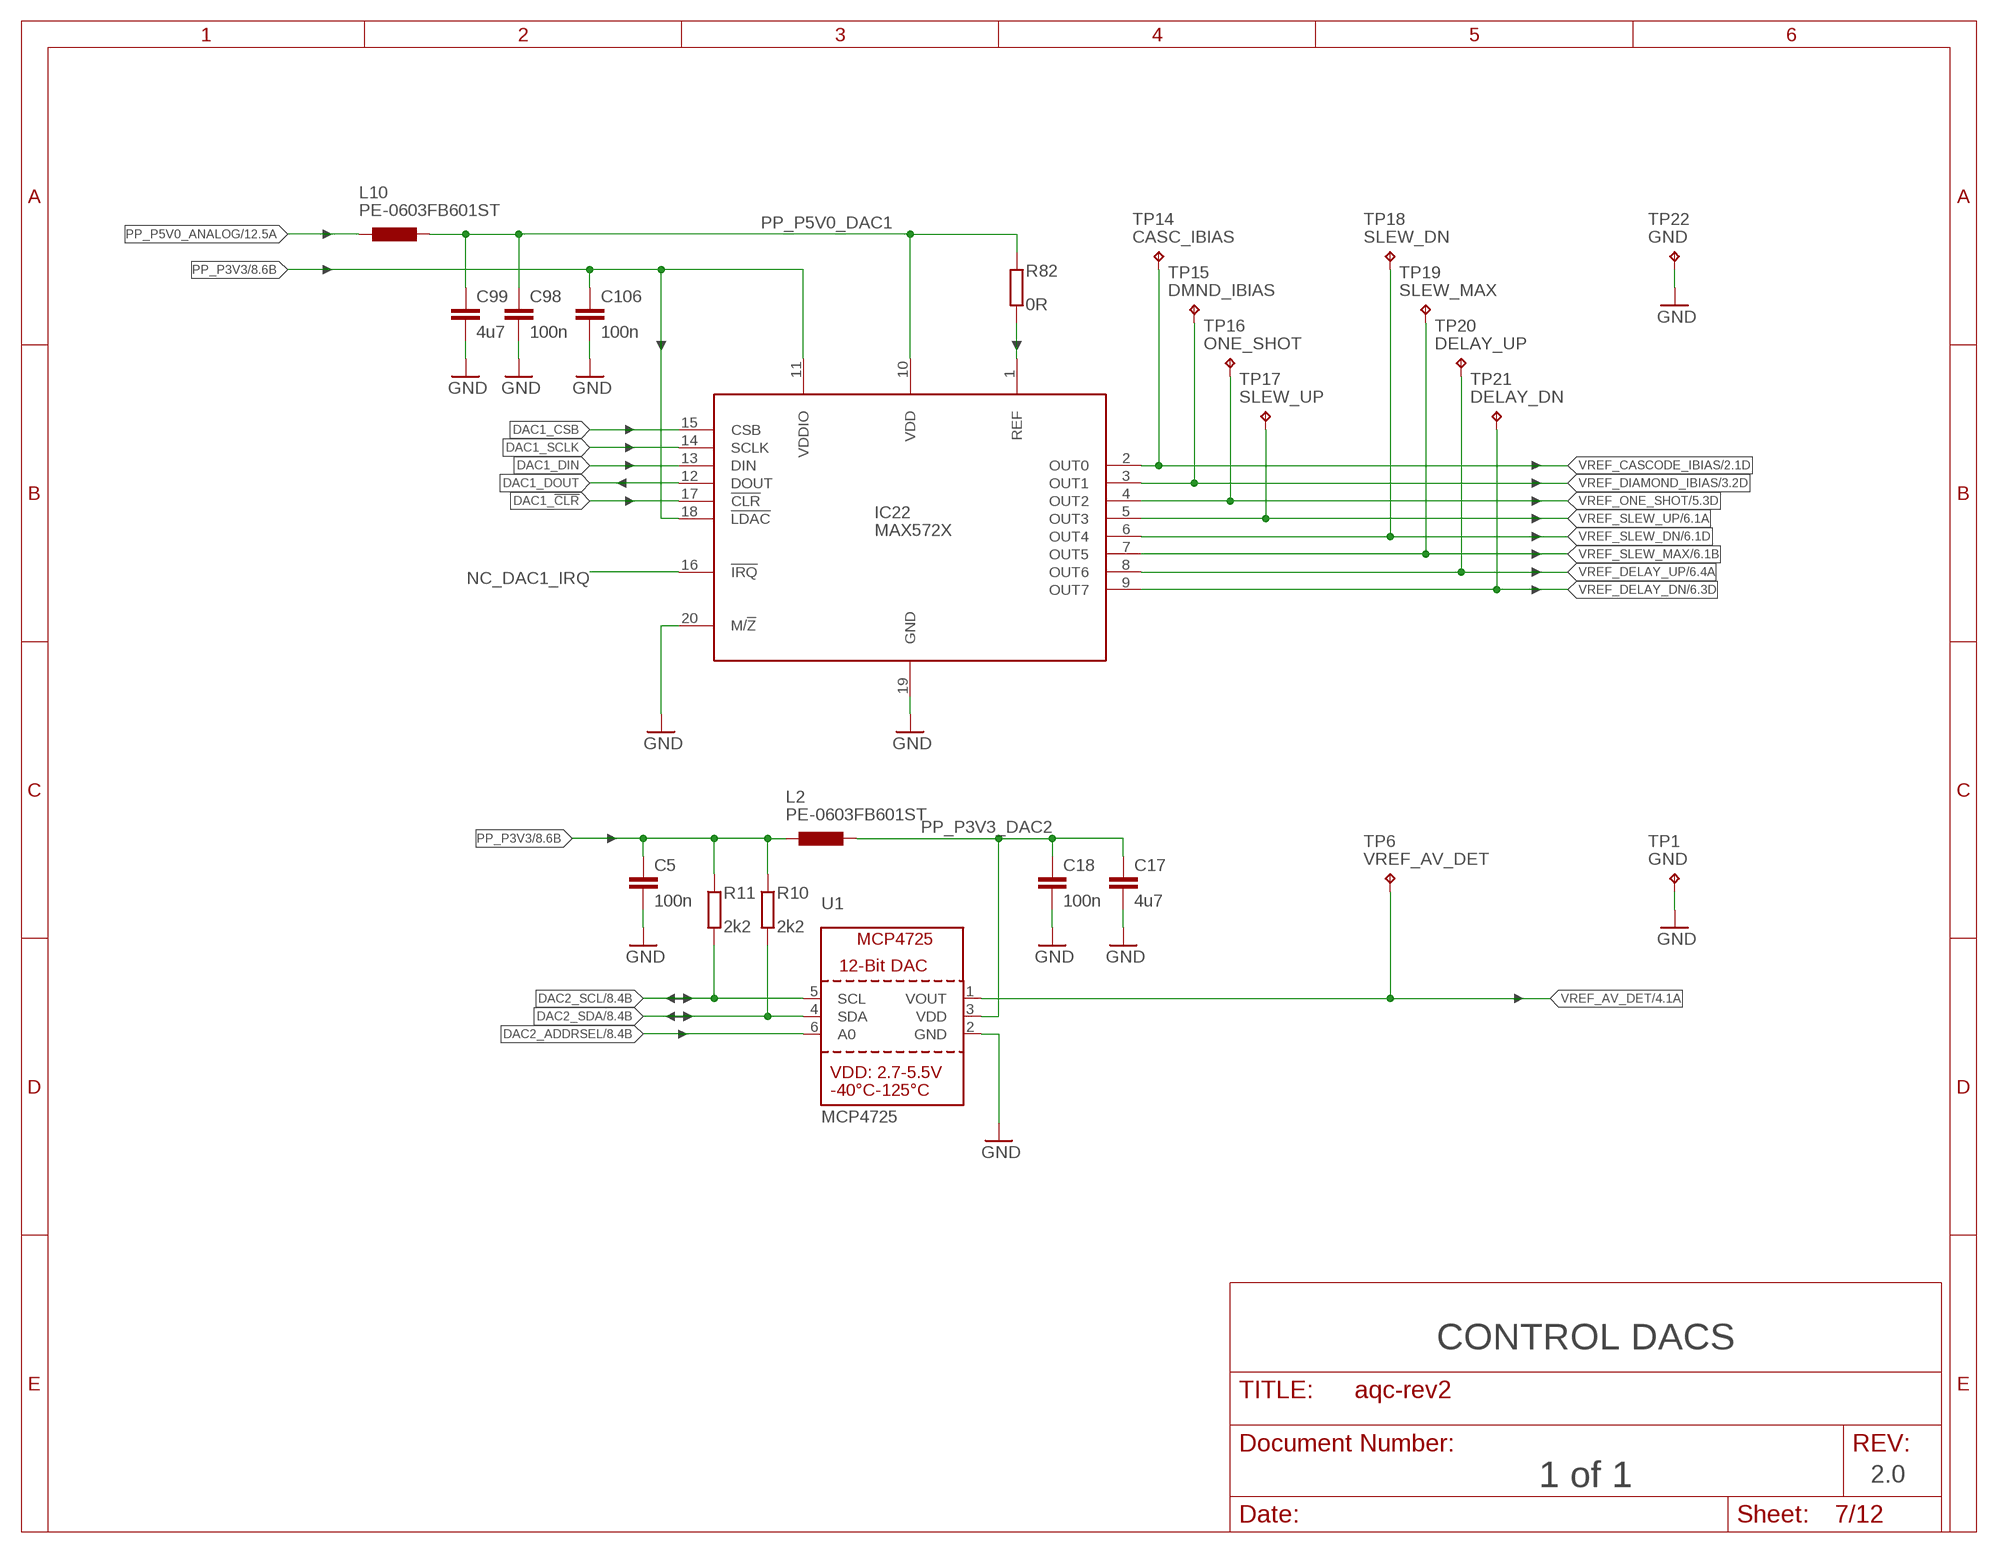
[diagram p6: schematic, sheet 7]

### Parts
C5  100n  C-EUC0603  [C0603]
C17  4u7  C-EUC0603  [C0603]
C18  100n  C-EUC0603  [C0603]
C98  100n  C-EUC0603  [C0603]
C99  4u7  C-EUC0603  [C0603]
C106  100n  C-EUC0603  [C0603]
IC22  MAX572X  [TSSOP20]
L2  PE-0603FB601ST  INDUCTOR0603  [R0603]
L10  PE-0603FB601ST  INDUCTOR0603  [R0603]
R10  2k2  R-EU_R0603  [R0603]
R11  2k2  R-EU_R0603  [R0603]
R82  0R  R-EU_R0603  [R0603]
TP1  GND  KEYSTONE_5000  [KEYSTONE_5000_MINIATURE]
TP6  VREF_AV_DET  KEYSTONE_5000  [KEYSTONE_5000_MINIATURE]
TP14  CASC_IBIAS  KEYSTONE_5000  [KEYSTONE_5000_MINIATURE]
TP15  DMND_IBIAS  KEYSTONE_5000  [KEYSTONE_5000_MINIATURE]
TP16  ONE_SHOT  KEYSTONE_5000  [KEYSTONE_5000_MINIATURE]
TP17  SLEW_UP  KEYSTONE_5000  [KEYSTONE_5000_MINIATURE]
TP18  SLEW_DN  KEYSTONE_5000  [KEYSTONE_5000_MINIATURE]
TP19  SLEW_MAX  KEYSTONE_5000  [KEYSTONE_5000_MINIATURE]
TP20  DELAY_UP  KEYSTONE_5000  [KEYSTONE_5000_MINIATURE]
TP21  DELAY_DN  KEYSTONE_5000  [KEYSTONE_5000_MINIATURE]
TP22  GND  KEYSTONE_5000  [KEYSTONE_5000_MINIATURE]
U1  MCP4725  DAC_MCP4725  [SOT23-6]

### Nets
DAC1_!CLR: IC22.17(!CLR) ; also sheet 8
DAC1_CSB: IC22.15(CSB) ; also sheet 8
DAC1_DIN: IC22.13(DIN) ; also sheet 8
DAC1_DOUT: IC22.12(DOUT) ; also sheet 8
DAC1_SCLK: IC22.14(SCLK) ; also sheet 8
DAC2_ADDRSEL: U1.6(A0) ; also sheet 8
DAC2_SCL: R11.2 U1.5(SCL) ; also sheet 8
DAC2_SDA: R10.2 U1.4(SDA) ; also sheet 8
GND: C5.2 C17.2 C18.2 C98.2 C99.2 C106.2 IC22.19(GND) IC22.20(M/!Z) TP1.P$1 TP22.P$1 U1.2(GND) ; also sheet 2,3,4,5,6,8,9,10,11,12
N$92: IC22.1(REF) R82.2
NC_DAC1_IRQ: IC22.16(!IRQ)
PP_P3V3: C5.1 C106.1 IC22.11(VDDIO) IC22.18(!LDAC) L2.1 R10.1 R11.1 ; also sheet 4,5,6,8,9
PP_P3V3_DAC2: C17.1 C18.1 L2.2 U1.3(VDD)
PP_P5V0_ANALOG: L10.1 ; also sheet 2,3,4,6,12
PP_P5V0_DAC1: C98.1 C99.1 IC22.10(VDD) L10.2 R82.1
VREF_AV_DET: TP6.P$1 U1.1(VOUT) ; also sheet 4
VREF_CASCODE_IBIAS: IC22.2(OUT0) TP14.P$1 ; also sheet 2
VREF_DELAY_DN: IC22.9(OUT7) TP21.P$1 ; also sheet 6
VREF_DELAY_UP: IC22.8(OUT6) TP20.P$1 ; also sheet 6
VREF_DIAMOND_IBIAS: IC22.3(OUT1) TP15.P$1 ; also sheet 3
VREF_ONE_SHOT: IC22.4(OUT2) TP16.P$1 ; also sheet 5
VREF_SLEW_DN: IC22.6(OUT4) TP18.P$1 ; also sheet 6
VREF_SLEW_MAX: IC22.7(OUT5) TP19.P$1 ; also sheet 6
VREF_SLEW_UP: IC22.5(OUT3) TP17.P$1 ; also sheet 6

### Notes on the sheet
- CONTROL DACS
- 1 of 1 | 2.0

## Sheet 8 of 12
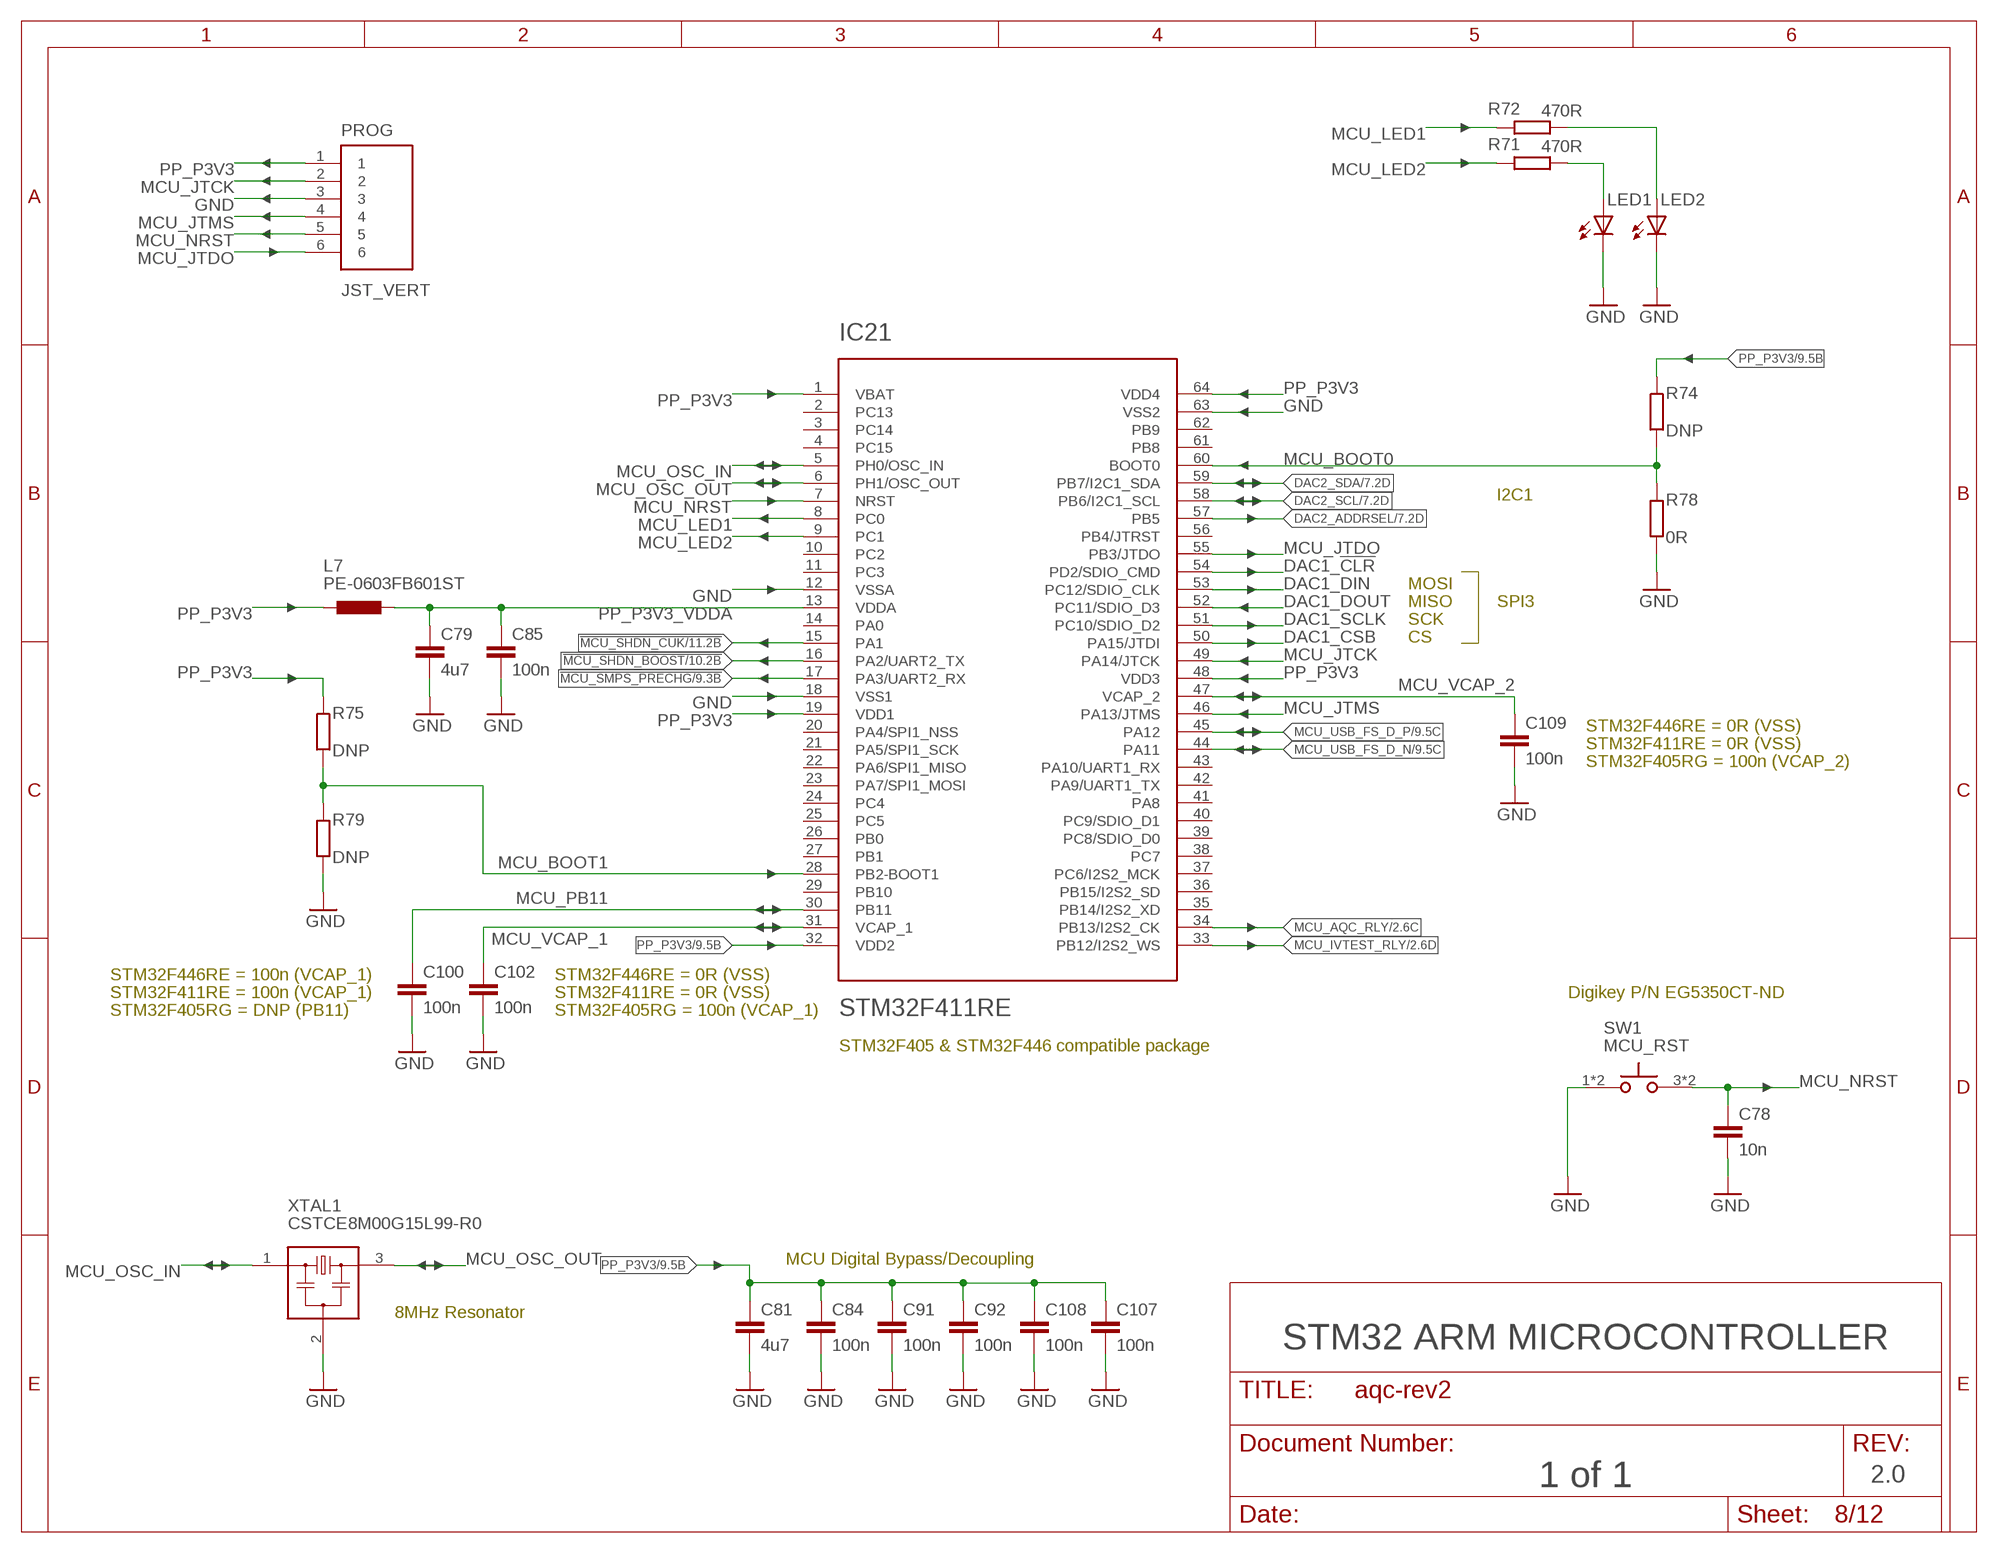
[diagram p7: schematic, sheet 8]

### Parts
C78  10n  C-EUC0603  [C0603]
C79  4u7  C-EUC0603  [C0603]
C81  4u7  C-EUC0603  [C0603]
C84  100n  C-EUC0603  [C0603]
C85  100n  C-EUC0603  [C0603]
C91  100n  C-EUC0603  [C0603]
C92  100n  C-EUC0603  [C0603]
C100  100n  C-EUC0603  [C0603]
C102  100n  C-EUC0603  [C0603]
C107  100n  C-EUC0603  [C0603]
C108  100n  C-EUC0603  [C0603]
C109  100n  C-EUC0603  [C0603]
IC21  STM32F411RE  STM32F405RG  [TQFP64_STM32]
L7  PE-0603FB601ST  INDUCTOR0603  [R0603]
LED1  LEDCHIP-LED0805  [CHIP-LED0805]
LED2  LEDCHIP-LED0805  [CHIP-LED0805]
PROG  JST_VERT  JST_VERTICAL  [JST-6-SMD-VERT-1.0MM]
R71  470R  R-EU_R0603  [R0603]
R72  470R  R-EU_R0603  [R0603]
R74  DNP  R-EU_R0603  [R0603]
R75  DNP  R-EU_R0603  [R0603]
R78  0R  R-EU_R0603  [R0603]
R79  DNP  R-EU_R0603  [R0603]
SW1  MCU_RST  E-SWITCH-TL3305AF160QG  [E-SWITCH-TL3305AF160QG]
XTAL1  CSTCE8M00G15L99-R0  MURATA_CSTCE_G15L/CSTCE_GH5L  [CSTCE_G15L/CSTCE_GH5L]

### Nets
!MCU_SHDN_BOOST: IC21.16(PA2/UART2_TX) ; also sheet 10
!MCU_SHDN_CUK: IC21.15(PA1) ; also sheet 11
!MCU_SMPS_PRECHG: IC21.17(PA3/UART2_RX) ; also sheet 9
DAC1_!CLR: IC21.54(PD2/SDIO_CMD) ; also sheet 7
DAC1_CSB: IC21.50(PA15/JTDI) ; also sheet 7
DAC1_DIN: IC21.53(PC12/SDIO_CLK) ; also sheet 7
DAC1_DOUT: IC21.52(PC11/SDIO_D3) ; also sheet 7
DAC1_SCLK: IC21.51(PC10/SDIO_D2) ; also sheet 7
DAC2_ADDRSEL: IC21.57(PB5) ; also sheet 7
DAC2_SCL: IC21.58(PB6/I2C1_SCL) ; also sheet 7
DAC2_SDA: IC21.59(PB7/I2C1_SDA) ; also sheet 7
GND: C78.2 C79.2 C81.2 C84.2 C85.2 C91.2 C92.2 C100.2 C102.2 C107.2 C108.2 C109.2 IC21.12(VSSA) IC21.18(VSS1) IC21.63(VSS2) LED1.C LED2.C PROG.3 R78.2 R79.2 SW1.1 SW1.2 XTAL1.2(GND) ; also sheet 2,3,4,5,6,7,9,10,11,12
MCU_AQC_RLY: IC21.34(PB13/I2S2_CK) ; also sheet 2
MCU_BOOT0: IC21.60(BOOT0) R74.2 R78.1
MCU_BOOT1: IC21.28(PB2-BOOT1) R75.2 R79.1
MCU_IVTEST_RLY: IC21.33(PB12/I2S2_WS) ; also sheet 2
MCU_JTCK: IC21.49(PA14/JTCK) PROG.2
MCU_JTDO: IC21.55(PB3/JTDO) PROG.6
MCU_JTMS: IC21.46(PA13/JTMS) PROG.4
MCU_LED1: IC21.8(PC0) R72.2
MCU_LED2: IC21.9(PC1) R71.2
MCU_NRST: C78.1 IC21.7(NRST) PROG.5 SW1.3 SW1.4
MCU_OSC_IN: IC21.5(PH0/OSC_IN) XTAL1.1(LEFT)
MCU_OSC_OUT: IC21.6(PH1/OSC_OUT) XTAL1.3(RIGHT)
MCU_PB11: C100.1 IC21.30(PB11)
MCU_USB_FS_D_N [100OHM_DIFF]: IC21.44(PA11) ; also sheet 9
MCU_USB_FS_D_P [100OHM_DIFF]: IC21.45(PA12) ; also sheet 9
MCU_VCAP_1: C102.1 IC21.31(VCAP_1)
MCU_VCAP_2: C109.1 IC21.47(VCAP_2)
N$9: LED2.A R72.1
N$24: LED1.A R71.1
PP_P3V3: C81.1 C84.1 C91.1 C92.1 C107.1 C108.1 IC21.1(VBAT) IC21.19(VDD1) IC21.32(VDD2) IC21.48(VDD3) IC21.64(VDD4) L7.1 PROG.1 R74.1 R75.1 ; also sheet 4,5,6,7,9
PP_P3V3_VDDA: C79.1 C85.1 IC21.13(VDDA) L7.2
Unconnected: IC21.2(PC13) IC21.3(PC14) IC21.4(PC15) IC21.10(PC2) IC21.11(PC3) IC21.14(PA0) IC21.20(PA4/SPI1_NSS) IC21.21(PA5/SPI1_SCK) IC21.22(PA6/SPI1_MISO) IC21.23(PA7/SPI1_MOSI) IC21.24(PC4) IC21.25(PC5) IC21.26(PB0) IC21.27(PB1) IC21.29(PB10) IC21.35(PB14/I2S2_XD) IC21.36(PB15/I2S2_SD) IC21.37(PC6/I2S2_MCK) IC21.38(PC7) IC21.39(PC8/SDIO_D0) IC21.40(PC9/SDIO_D1) IC21.41(PA8) IC21.42(PA9/UART1_TX) IC21.43(PA10/UART1_RX) IC21.56(PB4/JTRST) IC21.61(PB8) IC21.62(PB9)

### Notes on the sheet
- I2C1
- MOSI
- MISO | SPI3
- SCK
- CS
- STM32F446RE = 0R (VSS)
- STM32F411RE = 0R (VSS)
- STM32F405RG = 100n (VCAP_2)
- STM32F446RE = 100n (VCAP_1) | STM32F446RE = 0R (VSS)
- STM32F411RE = 100n (VCAP_1) | STM32F411RE = 0R (VSS) | Digikey P/N EG5350CT-ND
- STM32F405RG = DNP (PB11) | STM32F405RG = 100n (VCAP_1)
- STM32F405 & STM32F446 compatible package
- MCU Digital Bypass/Decoupling
- 8MHz Resonator
- STM32 ARM MICROCONTROLLER
- 1 of 1 | 2.0

## Sheet 9 of 12
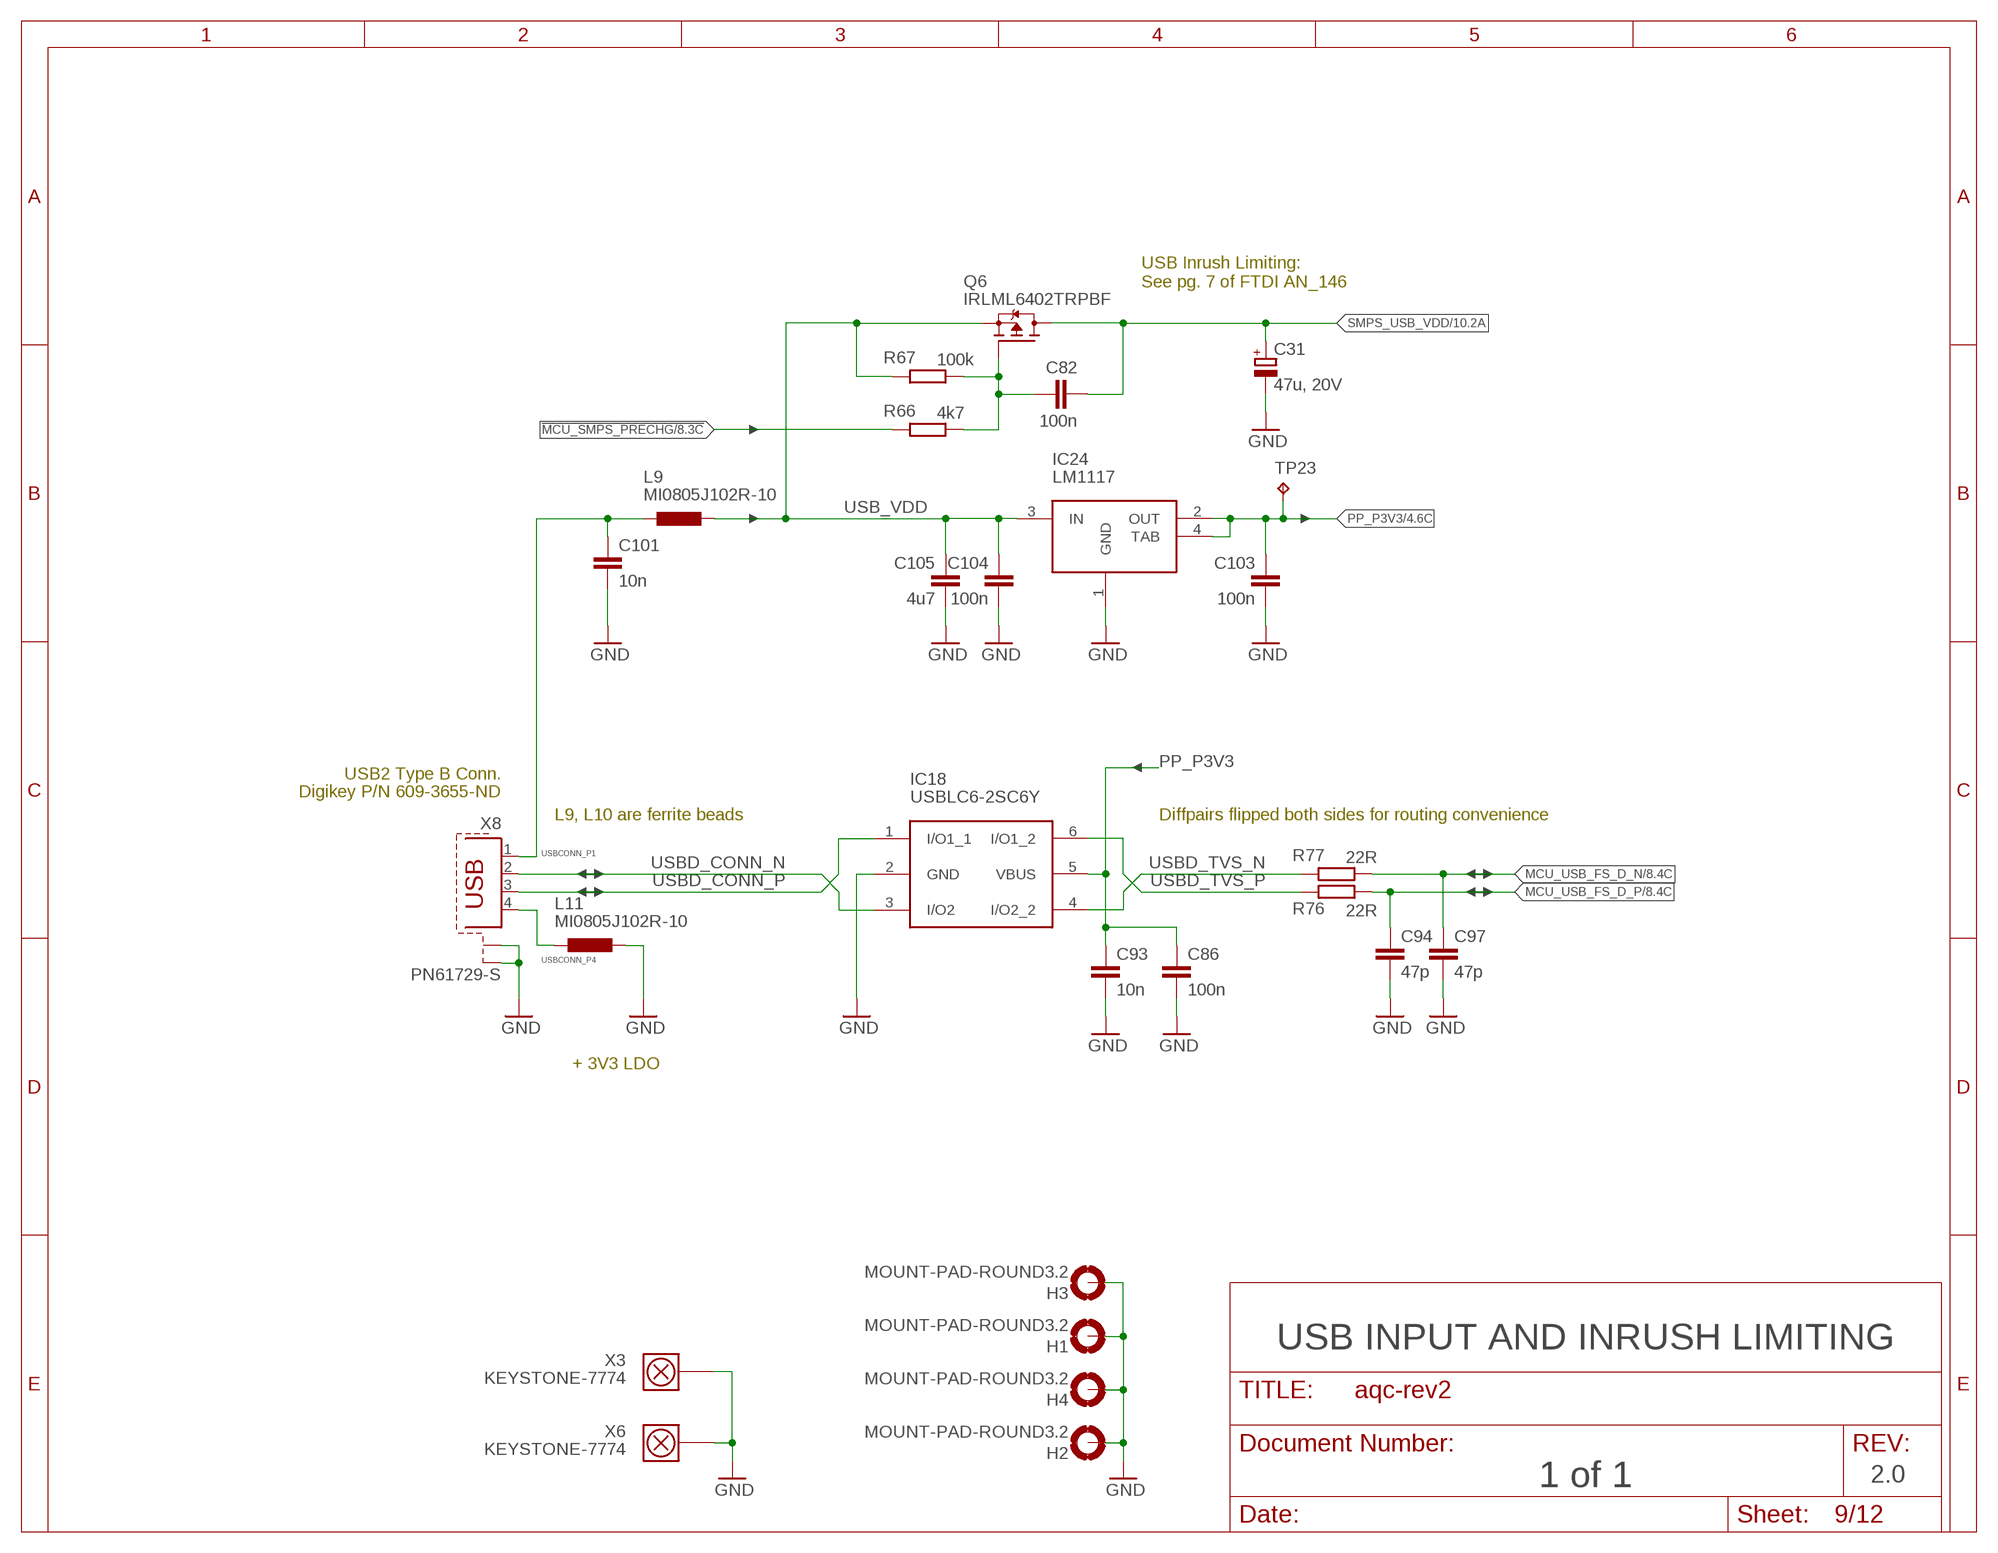
[diagram p8: schematic, sheet 9]

### Parts
C31  47u, 20V  CPOL-EUCT7343  [CT7343]
C82  100n  C-EUC0603  [C0603]
C86  100n  C-EUC0402  [C0402]
C93  10n  C-EUC0402  [C0402]
C94  47p  C-EUC0402  [C0402]
C97  47p  C-EUC0402  [C0402]
C101  10n  C-EUC0603  [C0603]
C103  100n  C-EUC0603  [C0603]
C104  100n  C-EUC0603  [C0603]
C105  4u7  C-EUC0603  [C0603]
H1  MOUNT-PAD-ROUND3.2  [3,2-PAD]
H2  MOUNT-PAD-ROUND3.2  [3,2-PAD]
H3  MOUNT-PAD-ROUND3.2  [3,2-PAD]
H4  MOUNT-PAD-ROUND3.2  [3,2-PAD]
IC18  USBLC6-2SC6Y  USBLC6  [SOT23-6L]
IC24  LM1117  [SOT-223]
L9  MI0805J102R-10  INDUCTOR0805  [R0805]
L11  MI0805J102R-10  INDUCTOR0805  [R0805]
Q6  IRLML6402TRPBF  MOSFET-PWIDE  [SOT23-WIDE]
R66  4k7  R-EU_R0603  [R0603]
R67  100k  R-EU_R0603  [R0603]
R76  22R  R-EU_R0402  [R0402]
R77  22R  R-EU_R0402  [R0402]
TP23  TPTP15R  [TP15R]
X3  KEYSTONE-7774  [KEYSTONE-7774]
X6  KEYSTONE-7774  [KEYSTONE-7774]
X8  PN61729-S  [PN61729-S]

### Nets
!MCU_SMPS_PRECHG: R66.2 ; also sheet 8
GND: C31.- C86.2 C93.2 C94.2 C97.2 C101.2 C103.2 C104.2 C105.2 H1.B3,2(MOUNT) H2.B3,2(MOUNT) H3.B3,2(MOUNT) H4.B3,2(MOUNT) IC18.2(GND) IC24.1(GND) L11.2 X3.1 X3.2 X3.3 X3.4 X6.1 X6.2 X6.3 X6.4 X8.S1 X8.S2 ; also sheet 2,3,4,5,6,7,8,10,11,12
MCU_USB_FS_D_N [100OHM_DIFF]: C97.1 R77.1 ; also sheet 8
MCU_USB_FS_D_P [100OHM_DIFF]: C94.1 R76.1 ; also sheet 8
N$12: C82.1 Q6.1(G) R66.1 R67.1
PP_P3V3: C86.1 C93.1 C103.1 IC18.5(VBUS) IC24.2(OUT) IC24.4(TAB) TP23.TP ; also sheet 4,5,6,7,8
SMPS_USB_VDD: C31.+ C82.2 Q6.3(D) ; also sheet 2,10,11
USB_VDD: C104.1 C105.1 IC24.3(IN) L9.2 Q6.2(S) R67.2
USBCONN_P1: C101.1 L9.1 X8.1
USBCONN_P4: L11.1 X8.4
USBD_CONN_N [100OHM_DIFF]: IC18.3(I/O2) X8.2
USBD_CONN_P [100OHM_DIFF]: IC18.1(I/O1_1) X8.3
USBD_TVS_N [100OHM_DIFF]: IC18.4(I/O2_2) R77.2
USBD_TVS_P [100OHM_DIFF]: IC18.6(I/O1_2) R76.2

### Notes on the sheet
- USB Inrush Limiting:
  See pg. 7 of FTDI AN_146
- USB2 Type B Conn.
- Digikey P/N 609-3655-ND
- L9, L10 are ferrite beads | Diffpairs flipped both sides for routing convenience
- + 3V3 LDO
- USB INPUT AND INRUSH LIMITING
- 1 of 1 | 2.0

## Sheet 10 of 12
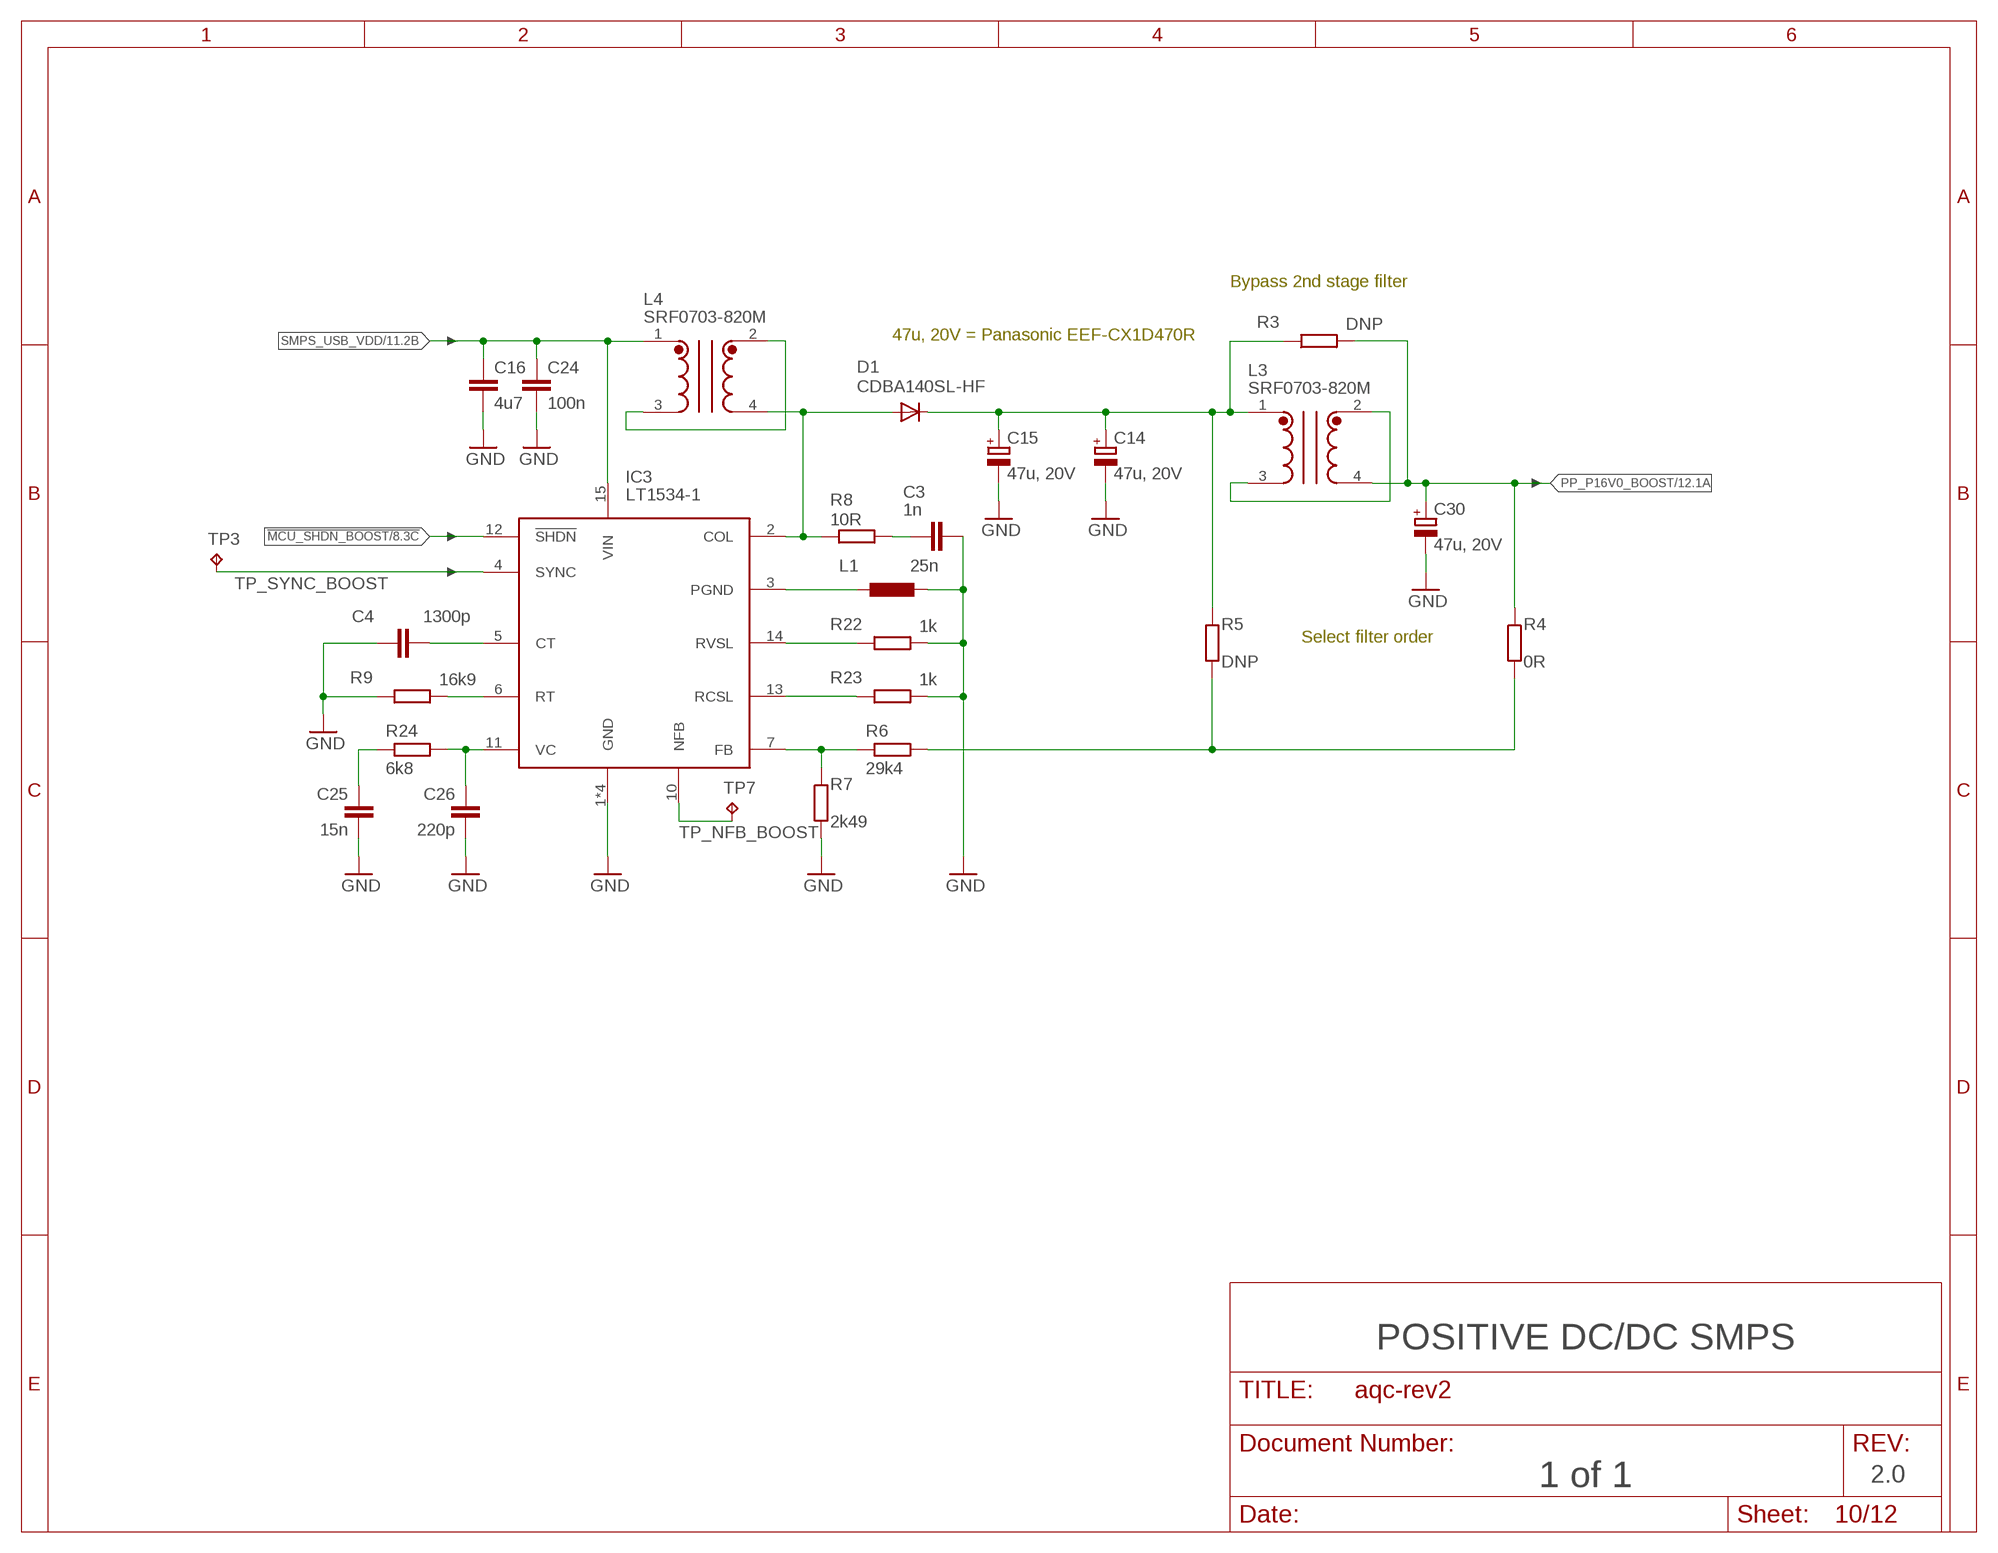
[diagram p9: schematic, sheet 10]

### Parts
C3  1n  C-EUC0603  [C0603]
C4  1300p  C-EUC0603  [C0603]
C14  47u, 20V  CPOL-EUCT7343  [CT7343]
C15  47u, 20V  CPOL-EUCT7343  [CT7343]
C16  4u7  C-EUC0805  [C0805]
C24  100n  C-EUC0603  [C0603]
C25  15n  C-EUC0603  [C0603]
C26  220p  C-EUC0603  [C0603]
C30  47u, 20V  CPOL-EUCT7343  [CT7343]
D1  CDBA140SL-HF  DIODE-DO214AC  [DO214AC]
IC3  LT1534-1  LT1534  [SO16]
L1  25n  INDUCTOR0603  [R0603]
L3  SRF0703-820M  SRF0703  [SRF0703]
L4  SRF0703-820M  SRF0703  [SRF0703]
R3  DNP  R-EU_R0603  [R0603]
R4  0R  R-EU_R0603  [R0603]
R5  DNP  R-EU_R0603  [R0603]
R6  29k4  R-EU_R0603  [R0603]
R7  2k49  R-EU_R0603  [R0603]
R8  10R  R-EU_R0603  [R0603]
R9  16k9  R-EU_R0603  [R0603]
R22  1k  R-EU_R0603  [R0603]
R23  1k  R-EU_R0603  [R0603]
R24  6k8  R-EU_R0603  [R0603]
TP3  TPB1,27  [B1,27]
TP7  TPB1,27  [B1,27]

### Nets
!MCU_SHDN_BOOST: IC3.12(!SHDN) ; also sheet 8
BOOST_STAGE1: C14.+ C15.+ D1.C L3.1 R3.1 R5.1
BOOST_SW_NODE: D1.A IC3.2(COL) L4.4 R8.1
GND: C3.1 C4.2 C14.- C15.- C16.2 C24.2 C25.2 C26.2 C30.- IC3.1(GND) IC3.8(GND) IC3.9(GND) IC3.16(GND) L1.2 R7.2 R9.1 R22.2 R23.2 ; also sheet 2,3,4,5,6,7,8,9,11,12
LBOOST_2: L3.2 L3.3
LBOOST_!: L4.2 L4.3
N$18: IC3.7(FB) R6.1 R7.1
N$19: IC3.3(PGND) L1.1
N$39: C4.1 IC3.5(CT)
N$51: IC3.13(RCSL) R23.1
N$52: IC3.14(RVSL) R22.1
N$54: C3.2 R8.2
N$55: C25.1 R24.1
N$56: C26.1 IC3.11(VC) R24.2
N$57: IC3.6(RT) R9.2
N$73: R4.2 R5.2 R6.2
PP_P16V0_BOOST: C30.+ L3.4 R3.2 R4.1 ; also sheet 12
SMPS_USB_VDD: C16.1 C24.1 IC3.15(VIN) L4.1 ; also sheet 2,9,11
TP_NFB_BOOST: IC3.10(NFB) TP7.TP
TP_SYNC_BOOST: IC3.4(SYNC) TP3.TP

### Notes on the sheet
- Bypass 2nd stage filter
- 47u, 20V = Panasonic EEF-CX1D470R
- Select filter order
- POSITIVE DC/DC SMPS
- 1 of 1 | 2.0

## Sheet 11 of 12
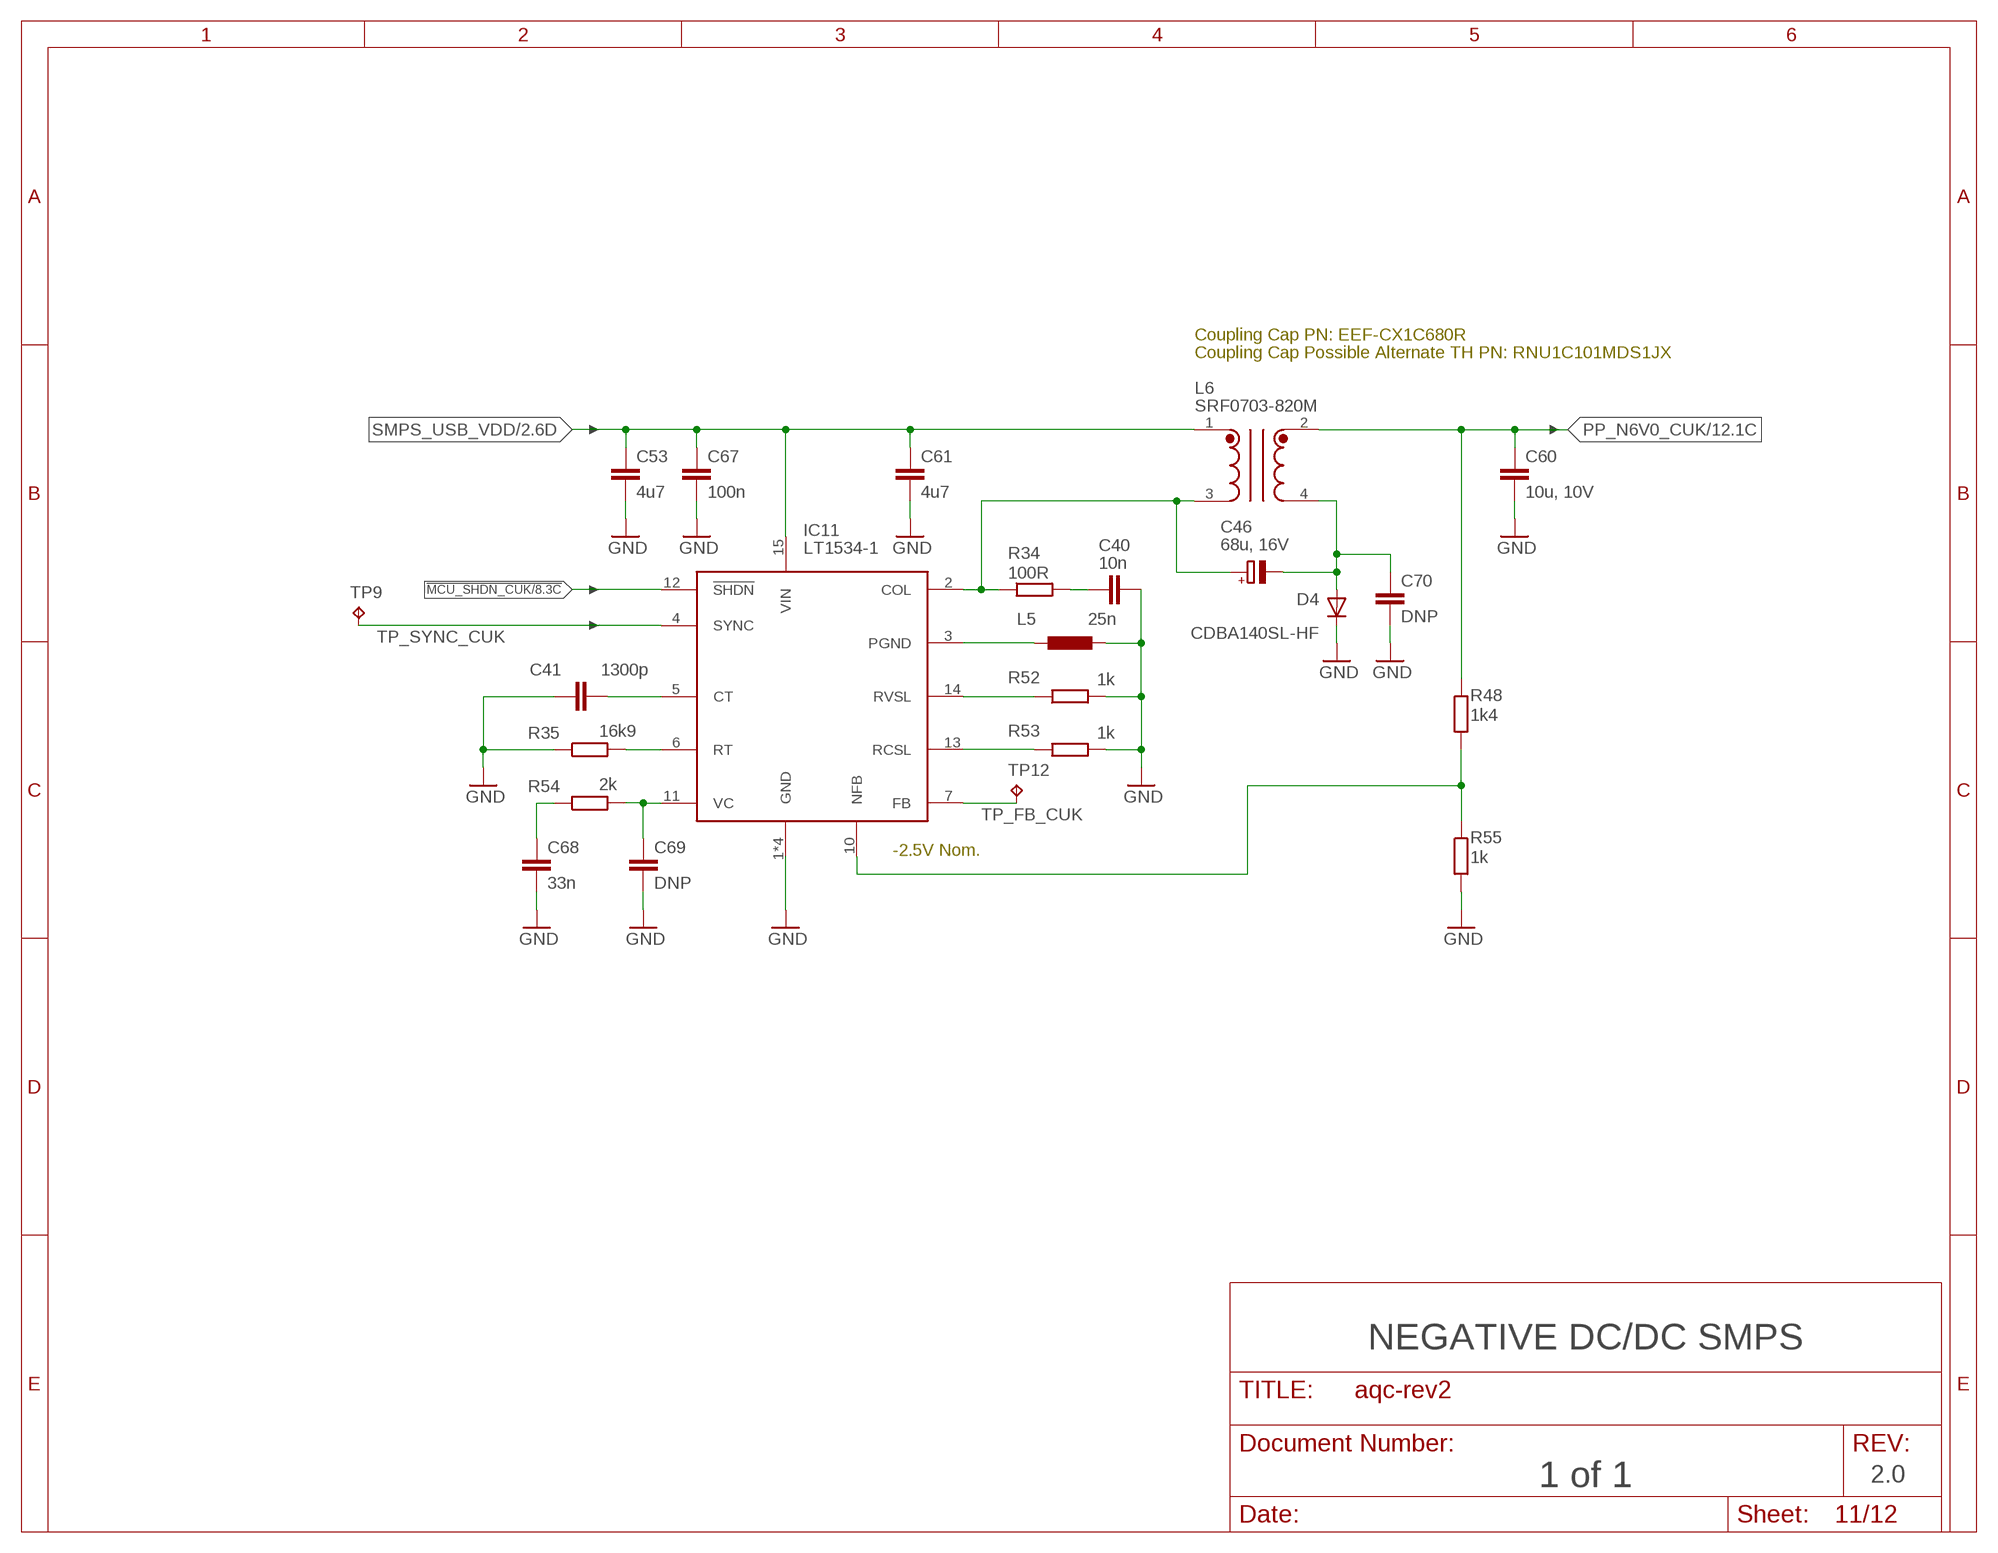
[diagram p10: schematic, sheet 11]

### Parts
C40  10n  C-EUC0603  [C0603]
C41  1300p  C-EUC0603  [C0603]
C46  68u, 16V  CPOL-EUCT7343  [CT7343]
C53  4u7  C-EUC0805  [C0805]
C60  10u, 10V  C-EUC0805  [C0805]
C61  4u7  C-EUC0805  [C0805]
C67  100n  C-EUC0603  [C0603]
C68  33n  C-EUC0603  [C0603]
C69  DNP  C-EUC0603  [C0603]
C70  DNP  C-EUC0603  [C0603]
D4  CDBA140SL-HF  DIODE-DO214AC  [DO214AC]
IC11  LT1534-1  LT1534  [SO16]
L5  25n  INDUCTOR0603  [R0603]
L6  SRF0703-820M  SRF0703  [SRF0703]
R34  100R  R-EU_R0603  [R0603]
R35  16k9  R-EU_R0603  [R0603]
R48  1k4  R-EU_R0603  [R0603]
R52  1k  R-EU_R0603  [R0603]
R53  1k  R-EU_R0603  [R0603]
R54  2k  R-EU_R0603  [R0603]
R55  1k  R-EU_R0603  [R0603]
TP9  TPB1,27  [B1,27]
TP12  TPB1,27  [B1,27]

### Nets
!MCU_SHDN_CUK: IC11.12(!SHDN) ; also sheet 8
GND: C40.2 C41.2 C53.2 C60.2 C61.2 C67.2 C68.2 C69.2 C70.2 D4.C IC11.1(GND) IC11.8(GND) IC11.9(GND) IC11.16(GND) L5.2 R35.1 R52.2 R53.2 R55.2 ; also sheet 2,3,4,5,6,7,8,9,10,12
N$8: C41.1 IC11.5(CT)
N$20: IC11.3(PGND) L5.1
N$60: IC11.13(RCSL) R53.1
N$61: IC11.14(RVSL) R52.1
N$62: C40.1 R34.2
N$63: C68.1 R54.1
N$64: C69.1 IC11.11(VC) R54.2
N$65: IC11.6(RT) R35.2
N$67: IC11.10(NFB) R48.2 R55.1
N$68: C46.+ IC11.2(COL) L6.3 R34.1
N$69: C46.- C70.1 D4.A L6.4
PP_N6V0_CUK: C60.1 L6.2 R48.1 ; also sheet 12
SMPS_USB_VDD: C53.1 C61.1 C67.1 IC11.15(VIN) L6.1 ; also sheet 2,9,10
TP_FB_CUK: IC11.7(FB) TP12.TP
TP_SYNC_CUK: IC11.4(SYNC) TP9.TP

### Notes on the sheet
- Coupling Cap PN: EEF-CX1C680R
- Coupling Cap Possible Alternate TH PN: RNU1C101MDS1JX
- -2.5V Nom.
- NEGATIVE DC/DC SMPS
- 1 of 1 | 2.0

## Sheet 12 of 12
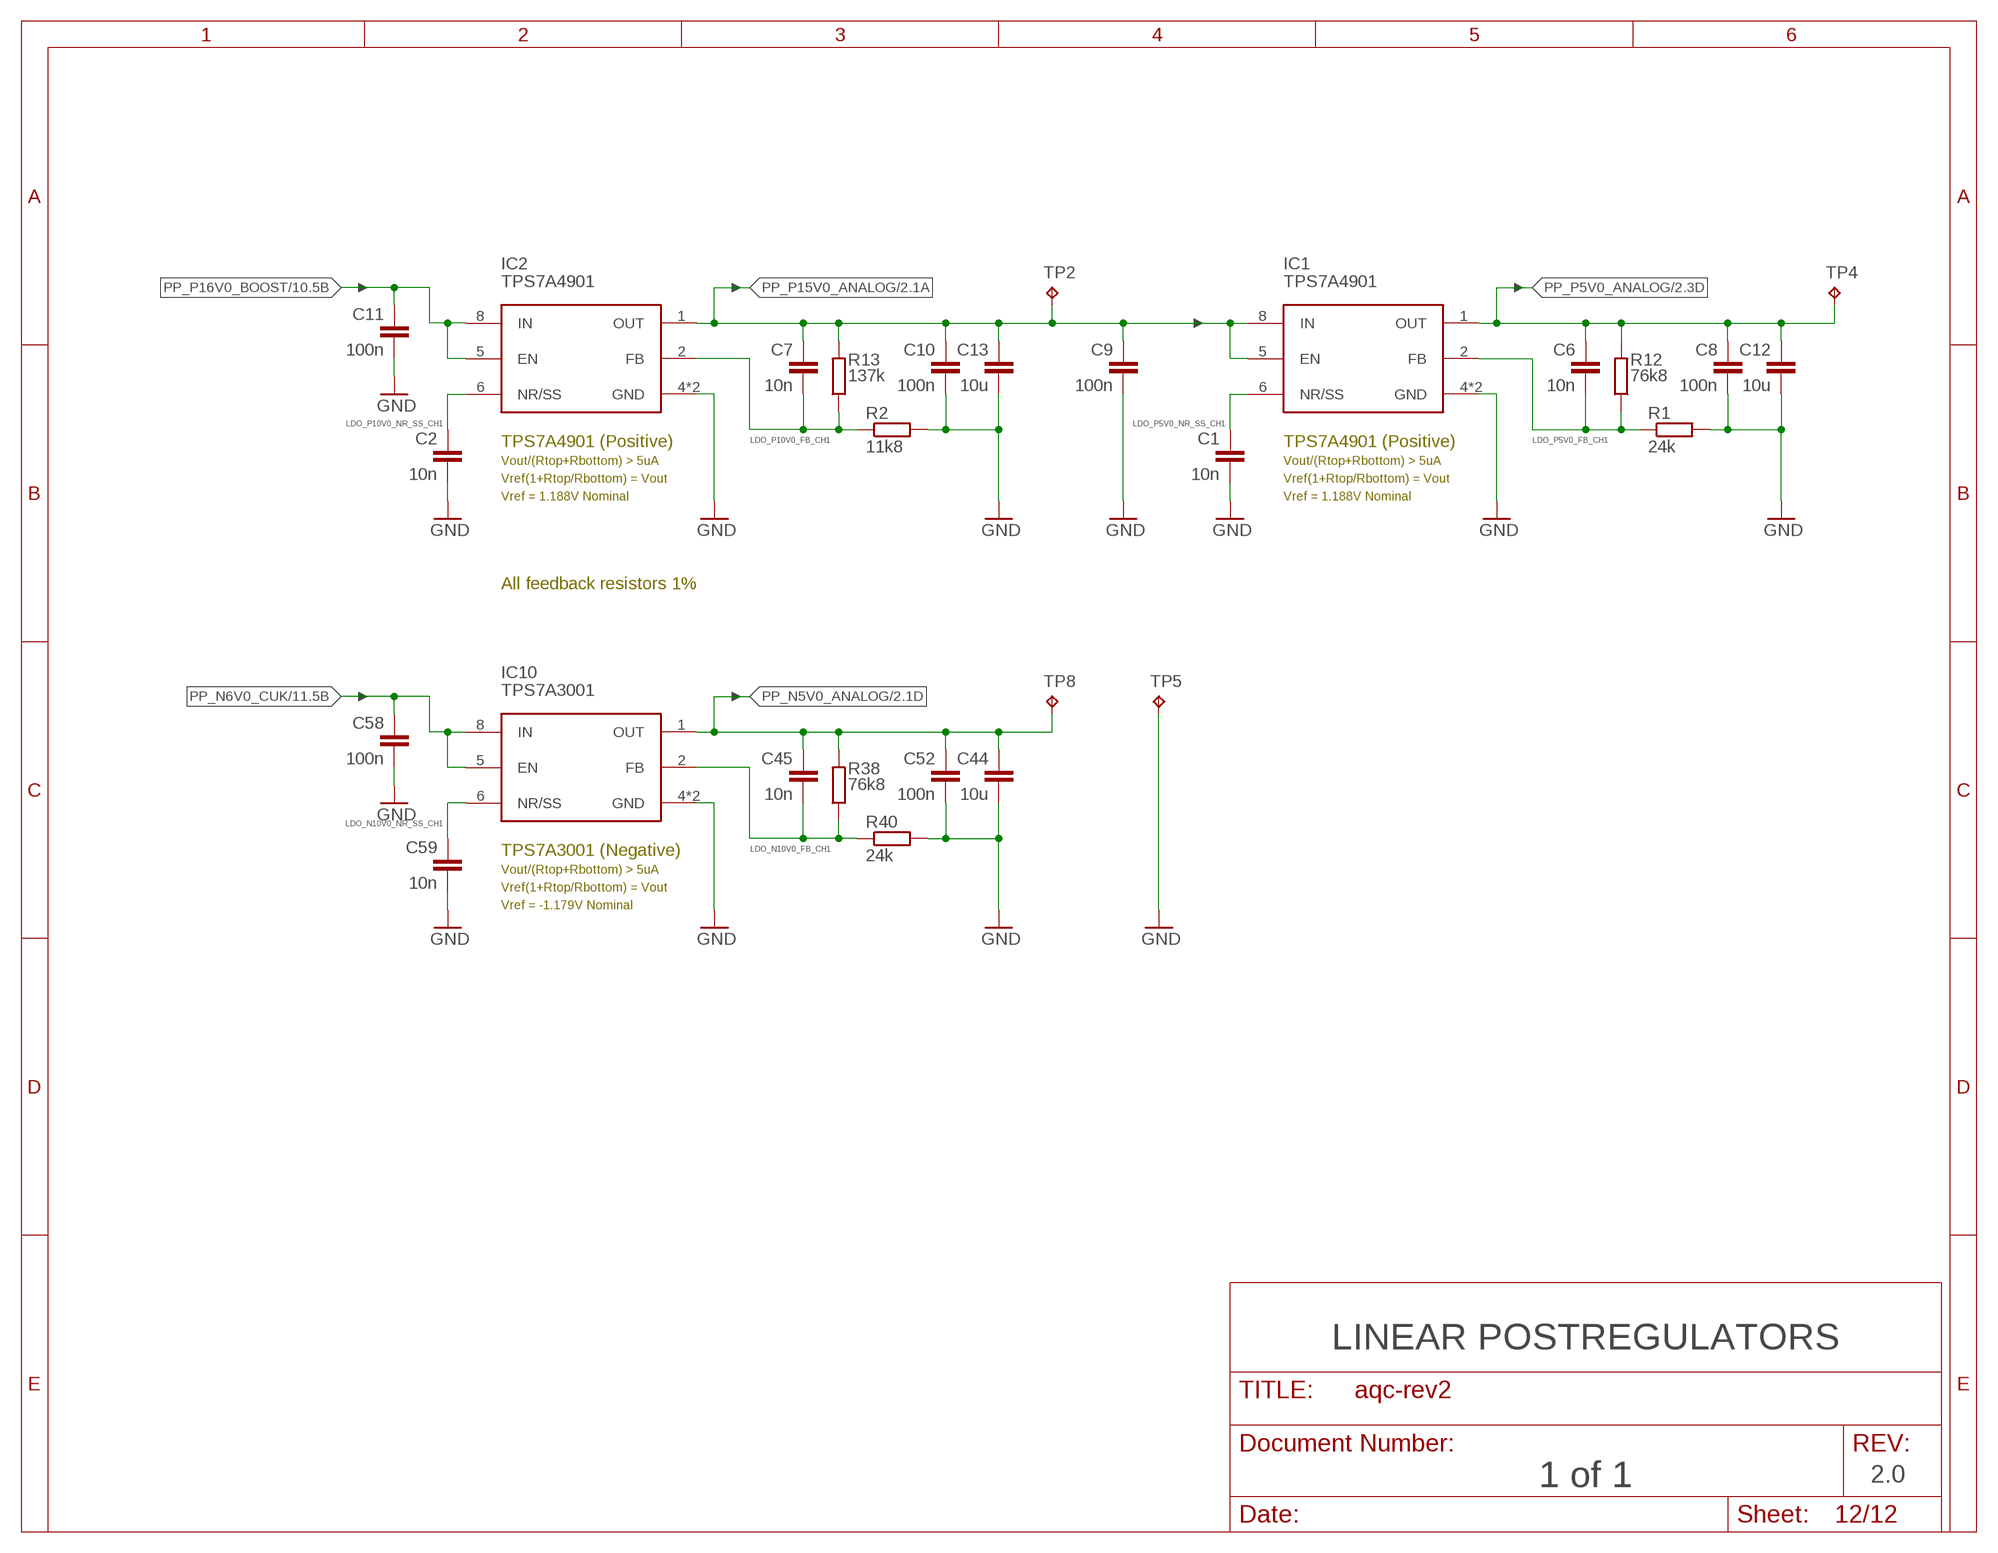
[diagram p11: schematic, sheet 12]

### Parts
C1  10n  C-EUC0603  [C0603]
C2  10n  C-EUC0603  [C0603]
C6  10n  C-EUC0603  [C0603]
C7  10n  C-EUC0603  [C0603]
C8  100n  C-EUC0603  [C0603]
C9  100n  C-EUC0603  [C0603]
C10  100n  C-EUC0603  [C0603]
C11  100n  C-EUC0603  [C0603]
C12  10u  C-EUC0805  [C0805]
C13  10u  C-EUC0805  [C0805]
C44  10u  C-EUC0805  [C0805]
C45  10n  C-EUC0603  [C0603]
C52  100n  C-EUC0603  [C0603]
C58  100n  C-EUC0603  [C0603]
C59  10n  C-EUC0603  [C0603]
IC1  TPS7A4901  TPS7A  [MSOP-8_POWER_PAD]
IC2  TPS7A4901  TPS7A  [MSOP-8_POWER_PAD]
IC10  TPS7A3001  TPS7A  [MSOP-8_POWER_PAD]
R1  24k  R-EU_R0603  [R0603]
R2  11k8  R-EU_R0603  [R0603]
R12  76k8  R-EU_R0603  [R0603]
R13  137k  R-EU_R0603  [R0603]
R38  76k8  R-EU_R0603  [R0603]
R40  24k  R-EU_R0603  [R0603]
TP2  TPTP15R  [TP15R]
TP4  TPTP15R  [TP15R]
TP5  TPTP15R  [TP15R]
TP8  TPTP15R  [TP15R]

### Nets
GND: C1.2 C2.2 C8.2 C9.2 C10.2 C11.2 C12.2 C13.2 C44.2 C52.2 C58.2 C59.2 IC1.4(GND) IC1.PAD(GND) IC2.4(GND) IC2.PAD(GND) IC10.4(GND) IC10.PAD(GND) R1.2 R2.2 R40.2 TP5.TP ; also sheet 2,3,4,5,6,7,8,9,10,11
LDO_N10V0_FB_CH1: C45.2 IC10.2(FB) R38.1 R40.1
LDO_N10V0_NR_SS_CH1: C59.1 IC10.6(NR/SS)
LDO_P5V0_FB_CH1: C6.2 IC1.2(FB) R1.1 R12.1
LDO_P5V0_NR_SS_CH1: C1.1 IC1.6(NR/SS)
LDO_P10V0_FB_CH1: C7.2 IC2.2(FB) R2.1 R13.1
LDO_P10V0_NR_SS_CH1: C2.1 IC2.6(NR/SS)
PP_N5V0_ANALOG: C44.1 C45.1 C52.1 IC10.1(OUT) R38.2 TP8.TP ; also sheet 2,4,6
PP_N6V0_CUK: C58.1 IC10.5(EN) IC10.8(IN) ; also sheet 11
PP_P5V0_ANALOG: C6.1 C8.1 C12.1 IC1.1(OUT) R12.2 TP4.TP ; also sheet 2,3,4,6,7
PP_P15V0_ANALOG: C7.1 C9.1 C10.1 C13.1 IC1.5(EN) IC1.8(IN) IC2.1(OUT) R13.2 TP2.TP ; also sheet 2,3
PP_P16V0_BOOST: C11.1 IC2.5(EN) IC2.8(IN) ; also sheet 10

### Notes on the sheet
- TPS7A4901 (Positive) | TPS7A4901 (Positive)
- Vout/(Rtop+Rbottom) > 5uA | Vout/(Rtop+Rbottom) > 5uA
- Vref(1+Rtop/Rbottom) = Vout | Vref(1+Rtop/Rbottom) = Vout
- Vref = 1.188V Nominal | Vref = 1.188V Nominal
- All feedback resistors 1%
- TPS7A3001 (Negative)
- Vout/(Rtop+Rbottom) > 5uA
- Vref(1+Rtop/Rbottom) = Vout
- Vref = -1.179V Nominal
- LINEAR POSTREGULATORS
- 1 of 1 | 2.0

## Power pins joined to a net without a drawn wire
GND: X1.G@2(GND) X1.G@3(GND) X1.G@4(GND) X2.G@2(GND) X2.G@3(GND) X2.G@4(GND) X4.G@2(GND) X4.G@3(GND) X4.G@4(GND) X5.G@2(GND) X5.G@3(GND) X5.G@4(GND) X7.G@2(GND) X7.G@3(GND) X7.G@4(GND)
VBB: U3.4(VBB)

## Library data of the parts
C1-C13 C16-C29 C32-C45 C47-C82 C84-C111 = rcl:C-EU: CAPACITOR, European symbol
C14 C15 C30 C31 C46 C83 = rcl:CPOL-EU: POLARIZED CAPACITOR, European symbol
D1 D4 = diode:DIODE-: DIODE
D2 D3 D5-D8 = diode:BAS40: Silicon Schottky Diodes General-purpose diode for high-speed switching
H1-H4 = holes:MOUNT-PAD-ROUND: MOUNTING PAD, round
IC1 IC2 IC10 = Kramnik's Library:TPS7A*
IC3 IC11 = meng:LT1534
IC4 IC7 IC12 IC13 = 74xx-little-de:74*1G04: INVERTER Gate
IC5 = meng:ADCMP582: Ultrafast SiGe Voltage Comparator w/. PECL Outputs http://www.analog.com/media/en/technical-documentation/data-sheets/ADCMP580_581_582.pdf
IC6 = meng:DS1100L
IC8 = meng:NC7SV74K8X
IC9 IC16 = meng:TLV272
IC14 = meng:NC7WZ16P6X
IC15 = meng:LTC1711
IC17 IC23 = meng:TLV271
IC18 = meng:USBLC6
IC19 = meng:ALD1107
IC20 = meng:ALD1106
IC21 = meng:STM32F405RG: ARM DSP Chip used on the WAV Trigger board.; VALUE: STM32F405RG
IC22 = meng:MAX572X
IC24 = meng:LM1117
L1 L2 L5 L7-L11 = meng:INDUCTOR
L3 L4 L6 = meng:SRF0703; VALUE: SRF0703
LED1 LED2 = led:LED: LED OSRAM: - CHIPLED LG R971, LG N971, LY N971, LG Q971, LY Q971, LO R971, LY R971 LH N974, LH R974 LS Q976, LO Q976, LY Q976 LO Q996 - Hyper CHIPLED LW Q18S LB Q993, LB Q99A, LB R99A - SideLED LS A670, LO A670, LY A670, LG A670, LP A670 LB A673, LV A673, LT A673, LW A673 LH A674 LY A675 LS A676, LA A676, LO A676, LY A676, LW A676 LS A679, LY A679, LG A679 - Hyper Micro SIDELED® LS Y876, LA Y876, LO Y876, LY Y876 LT Y87S - SmartLED LW L88C, LW L88S LB L89C, LB L89S, LG L890 LS L89K, LO L89K, LY L89K LS L896, LA L896, LO L896, LY L896 - TOPLED LS T670, LO T670, LY T670, LG T670, LP T670 LSG T670, LSP T670, LSY T670, LOP T670, LYG T670 LG T671, LOG T671, LSG T671 LB T673, LV T673, LT T673, LW T673 LH T674 LS T676, LA T676, LO T676, LY T676, LB T676, LH T676, LSB T676, LW T676 LB T67C, LV T67C, LT T67C, LS T67K, LO T67K, LY T67K, LW E67C LS E67B, LA E67B, LO E67B, LY E67B, LB E67C, LV E67C, LT E67C LW T67C LS T679, LY T679, LG T679 LS T770, LO T770, LY T770, LG T770, LP T770 LB T773, LV T773, LT T773, LW T773 LH T774 LS E675, LA E675, LY E675, LS T675 LS T776, LA T776, LO T776, LY T776, LB T776 LHGB T686 LT T68C, LB T68C - Hyper Mini TOPLED® LB M676 - Mini TOPLED Santana® LG M470 LS M47K, LO M47K, LY M47K Source: http://www.osram.convergy.de LUXEON: - LUMILED® LXK2-PW12-R00, LXK2-PW12-S00, LXK2-PW14-U00, LXK2-PW14-V00 LXK2-PM12-R00, LXK2-PM12-S00, LXK2-PM14-U00 LXK2-PE12-Q00, LXK2-PE12-R00, LXK2-PE12-S00, LXK2-PE14-T00, LXK2-PE14-U00 LXK2-PB12-K00, LXK2-PB12-L00, LXK2-PB12-M00, LXK2-PB14-N00, LXK2-PB14-P00, LXK2-PB14-Q00 LXK2-PR12-L00, LXK2-PR12-M00, LXK2-PR14-Q00, LXK2-PR14-R00 LXK2-PD12-Q00, LXK2-PD12-R00, LXK2-PD12-S00 LXK2-PH12-R00, LXK2-PH12-S00 LXK2-PL12-P00, LXK2-PL12-Q00, LXK2-PL12-R00 Source: www.luxeon.com KINGBRIGHT: KA-3528ASYC Source: www.kingbright.com
M1-M3 = meng:BSS806N
PROG = SparkFun-Connectors:JST_VERTICAL; PROD_ID: CONN-08249
Q1-Q5 = transistor-pnp:MMBTH81*: PNP Transistror
Q6 = microbuilder:MOSFET-P: P-Channel Mosfet LEGEND VDS: Voltage Drain-Source ID: Drain Current RDS(ON): Drain-Source On-State Resistance VGS(TH): Gate-Source Threshold Voltage CISS: Drain-Source Input Capacitance SOT-23 Name VDS ID RDS(ON) VGS(TH) CISS Order Number IRLML5103 30V 760mA 600 mOhm -- 75pF @ 25V Digikey: IRLML5103PBFCT-ND IRLML6401 12V 4.3A 50 mOhm 950mV @ 250µA 830pF @ 10V Digikey: IRLML6401PBFTR-ND NTR0202PL 20V 400mA 800 mOhm 2.3V @ 250uA 70pF @ 5V Digikey: NTR0202PLT1GOSTR-ND NTR4101PT1G 20V 1.8A 85 mOhm 1.2V @ 250uA 675pF @ 10V Digikey: NTR4101PT1GOSCT-ND DMP2004K 20V 600mA 900 mOhm 1V @ 250uA 175pF @ 16V Digikey: DMP2004KDICT-ND PMV65XP 20V 3.9A 76 mOhm 950mV @ 1mA 725pF @ 20V Digikey: 568-2358-2-ND TO-252 Name VDS ID RDS(ON) VGS(TH) CISS Order Number AOD417 30V 25A 34 mOhm 3V @ 250µA 920pF @ 15V Digikey: 785-1106-2-ND
R1-R9 R12 R13 R22-R24 R34 R38 R40 R48 R52 R53 R55 R66 R67 R71 R72 R74-R79 = resistor:R-EU_: RESISTOR, European symbol
R10 R11 R14-R21 R25-R33 R35-R37 R39 R41-R47 R49-R51 R54 R56-R65 R68-R70 R73 R81-R84 = rcl:R-EU_: RESISTOR, European symbol
R80 = meng:DIVIDER_SOT23-5
RLY1 RLY2 = meng:MEDER_CRF05-1A: MEDER CRF05-1A RF Reed Relay in a ceramic surface mount package.
SW1 = meng:E-SWITCH-TL3305AF160QG
T1-T7 = transistor:*-NPN-: NPN Transistror BF959 corrected 2008.03.06
TP1 TP6 TP14-TP22 = Kramnik's Library:KEYSTONE_5000
TP2-TP5 TP7-TP9 TP11-TP13 TP23 = testpad:TP: Test pad
TP10 = meng:TP-SCOPE
U1 = microbuilder:DAC_MCP4725: MCP4725 - 12-Bit I2C DAC with on-board EEPROM Settling Time: 6 µs 2.7-5.5V Supply 100kHz, 400kHz, 3.4 Mbps I²C EEPROM can be used to store a specific output voltage which will be set coming out of reset I²C Address: 1100 A2 A1 A0 A0 is set via the A0 pin, A2 and A1 are hard-wired on the chip depending on the model chosen: Part Number A2 A1 Code MCP4725A0T-E/CH 0 0 AJNN MCP4725A1T-E/CH 0 1 APNN MCP4725A2T-E/CH 1 0 AQNN MCP4725A3T-E/CH 1 1 ARNN
U2 = Texas Instruments_By_element14_Batch_1:SN65EPT22DGK: Dual LVTTL/LVCMOS to Differential LVPECL Buffer; MPN: SN65EPT22DGK; OC_FARNELL: -; OC_NEWARK: 45P8158; PACKAGE: MSOP-8; SUPPLIER: Texas Instruments
U3 = Texas Instruments_By_element14_Batch_1:SN65EPT21DGK: 3.3-V Differential PECL/LVDS to TTL Translator; MPN: SN65EPT21DGK; OC_FARNELL: -; OC_NEWARK: 74R6512; PACKAGE: MSOP-8; SUPPLIER: Texas Instruments
X1 X2 X4 X5 X7 = meng:SMA-: SMA 50 Ohm End Launch Jack Receptacle - Round Contact Johnson Components Source: www.johnsoncomponents.com .. J502-ND.pdf; MF: JOHNSON COMPONENTS; MPN: 142-0711-871; OC_FARNELL: unknown; OC_NEWARK: 01C1639
X3 X6 = meng:KEYSTONE-7774
X8 = con-berg:PN61729-S: BERG USB connector; OC_FARNELL: unknown; OC_NEWARK: unknown
XTAL1 = meng:MURATA_CSTCE_G15L/CSTCE_GH5L; VALUE: CSTCE_G15L/CSTCE_GH5L

## Net classes
1 100OHM_DIFF: width 0.254 mm, clearance 0.254 mm